# Altium project PCI_board_universal.PrjPCB (part 1 of 2)
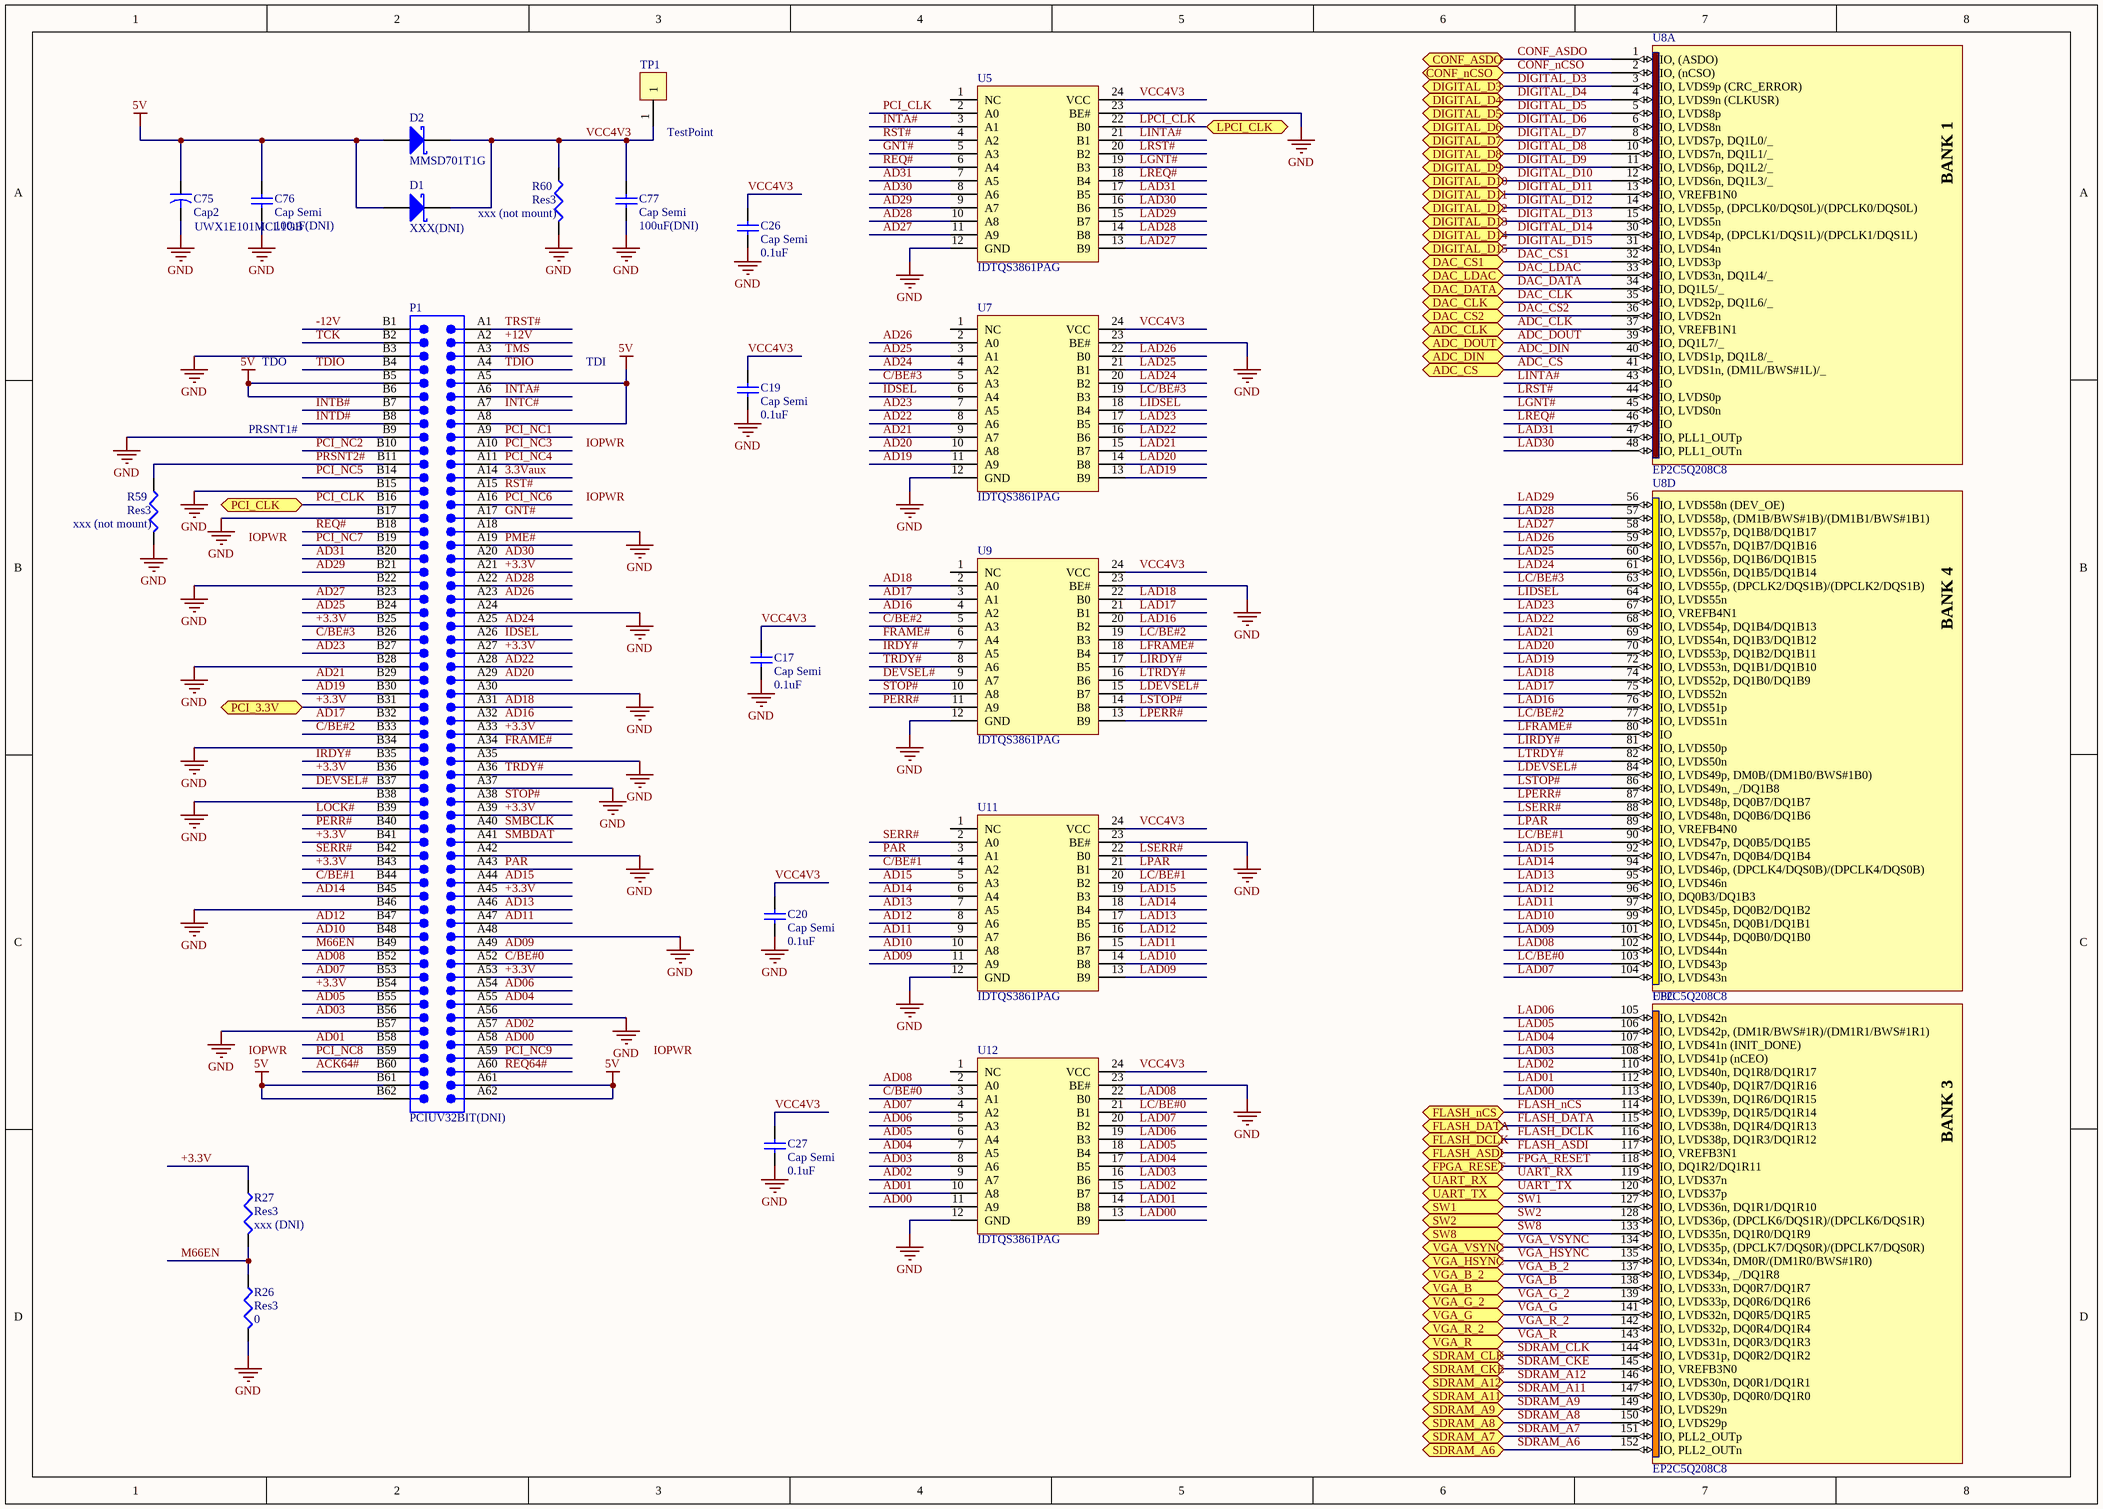
[diagram p0: PCI short card universal - 32 BIT.schdoc]
7 sheets, 200 parts. Net scope: flat (ports and power ports of the same name join across sheets).
Board file: PCI short card universal - 32 BIT.PCBDOC
Sheets:
  PCI short card universal - 32 BIT.schdoc
  PCI short card universal - 32 BIT-2.schdoc
  PCI short card universal - 32 BIT-3.schdoc
  PCI short card universal - 32 BIT-4.schdoc
  PCI short card universal - 32 BIT-5.schdoc
  PCI short card universal - 32 BIT-6.schdoc
  PCI short card universal - 32 BIT-7.schdoc

## Sheet PCI short card universal - 32 BIT.schdoc: PCI short card universal - 32 BIT
size A3; Organization: Organization; Address1: Address1; Address2: Address2; Address3: Address3; Address4: Address4; DocumentNumber: 1; Revision: 0; SheetNumber: 2; SheetTotal: 2; PageSetup: Record=PageOptions|CenterHorizontal=True|CenterVertical=True|PrintScale=0.70|XCorrection=1.00|YCorrection=1.00|PrintKind=1|BorderSize=5000000|LeftOffset=0|BottomOffset=0|Orientation=2|PaperLength=1000|PaperWidth=1000|Scale=100|PaperSource=15|PrintQuality=600|MediaType=1|DitherType=10|PaperKind=Letter|PrintScaleMode=1

### Parts
C17  Cap Semi  value 0.1uF  [RESC1608N]
C19  Cap Semi  value 0.1uF  [RESC1608N]
C20  Cap Semi  value 0.1uF  [RESC1608N]
C26  Cap Semi  value 0.1uF  [RESC1608N]
C27  Cap Semi  value 0.1uF  [RESC1608N]
C75  Cap2  value UWX1E101MCL1GB  [ECEL_D8]
C76  Cap Semi  value 100uF(DNI)  [CD3225-1210]
C77  Cap Semi  value 100uF(DNI)  [CD3225-1210]
D1  XXX(DNI)  [LED3.2X1.6X1.1]
D2  MMSD701T1G  [SOD-123]
P1  PCIUV32BIT(DNI)  [PCIUV32BIT]
R26  Res3  value 0  [RESC1608N]
R27  Res3  value xxx (DNI)  [RESC1608N]
R59  Res3  value xxx (not mount)  [RESC1608N]
R60  Res3  value xxx (not mount)  [RESC1608N]
TP1  TestPoint  [HDR1X1]
U5  IDTQS3861PAG  [TSSOP24(QS3681)]
U7  IDTQS3861PAG  [TSSOP24(QS3681)]
U8  EP2C5Q208C8  [PQFP208_N]  (parts A,C,D of 9)
U9  IDTQS3861PAG  [TSSOP24(QS3681)]
U11  IDTQS3861PAG  [TSSOP24(QS3681)]
U12  IDTQS3861PAG  [TSSOP24(QS3681)]

### Ports
ADC_CLK, ADC_CS, ADC_DIN, ADC_DOUT, CONF_ASDO, CONF_nCSO, DAC_CLK, DAC_CS1, DAC_CS2, DAC_DATA, DAC_LDAC, DIGITAL_D3, DIGITAL_D4, DIGITAL_D5, DIGITAL_D6, DIGITAL_D7, DIGITAL_D8, DIGITAL_D9, DIGITAL_D10, DIGITAL_D11, DIGITAL_D12, DIGITAL_D13, DIGITAL_D14, DIGITAL_D15, FLASH_ASDI, FLASH_DATA, FLASH_DCLK, FLASH_nCS, FPGA_RESET, LPCI_CLK, PCI_3.3V, PCI_CLK, SDRAM_A6, SDRAM_A7, SDRAM_A8, SDRAM_A9, SDRAM_A11, SDRAM_A12, SDRAM_CKE, SDRAM_CLK, SW1, SW2, SW8, UART_RX, UART_TX, VGA_B, VGA_B_2, VGA_G, VGA_G_2, VGA_HSYNC, VGA_R, VGA_R_2, VGA_VSYNC

### Nets
5V: C75.1 C76.2 D1.1(A) D2.1(A) P1.A5 P1.A8 P1.A61 P1.A62 P1.B5 P1.B6 P1.B61 P1.B62
GND: C17.1 C19.1 C20.1 C26.1 C27.1 C75.2 C76.1 C77.1 P1.A18 P1.A24 P1.A30 P1.A35 P1.A37 P1.A42 P1.A48 P1.A56 P1.B3 P1.B9 P1.B15 P1.B17 P1.B22 P1.B28 P1.B34 P1.B38 P1.B46 P1.B57 R26.2 R59.2 R60.2 U5.12(GND) U5.23(BE#) U7.12(GND) U7.23(BE#) U9.12(GND) U9.23(BE#) U11.12(GND) U11.23(BE#) U12.12(GND) U12.23(BE#)
3.3Vaux: P1.A14
+3.3V: P1.A21 P1.A27 P1.A33 P1.A39 P1.A45 P1.A53 P1.B25 P1.B31 P1.B36 P1.B41 P1.B43 P1.B54 R27.1 ; port PCI_3.3V
+12V: P1.A2
-12V: P1.B1
ACK64#: P1.B60
AD00: P1.A58 U12.11(A9)
AD01: P1.B58 U12.10(A8)
AD02: P1.A57 U12.9(A7)
AD03: P1.B56 U12.8(A6)
AD04: P1.A55 U12.7(A5)
AD05: P1.B55 U12.6(A4)
AD06: P1.A54 U12.5(A3)
AD07: P1.B53 U12.4(A2)
AD08: P1.B52 U12.2(A0)
AD09: P1.A49 U11.11(A9)
AD10: P1.B48 U11.10(A8)
AD11: P1.A47 U11.9(A7)
AD12: P1.B47 U11.8(A6)
AD13: P1.A46 U11.7(A5)
AD14: P1.B45 U11.6(A4)
AD15: P1.A44 U11.5(A3)
AD16: P1.A32 U9.4(A2)
AD17: P1.B32 U9.3(A1)
AD18: P1.A31 U9.2(A0)
AD19: P1.B30 U7.11(A9)
AD20: P1.A29 U7.10(A8)
AD21: P1.B29 U7.9(A7)
AD22: P1.A28 U7.8(A6)
AD23: P1.B27 U7.7(A5)
AD24: P1.A25 U7.4(A2)
AD25: P1.B24 U7.3(A1)
AD26: P1.A23 U7.2(A0)
AD27: P1.B23 U5.11(A9)
AD28: P1.A22 U5.10(A8)
AD29: P1.B21 U5.9(A7)
AD30: P1.A20 U5.8(A6)
AD31: P1.B20 U5.7(A5)
ADC_CLK: U8.37(IO,_VREFB1N1) ; port ADC_CLK
ADC_CS: U8.41(IO,_LVDS1n,_(DM1L/BWS#1L)/_) ; port ADC_CS
ADC_DIN: U8.40(IO,_LVDS1p,_DQ1L8/_) ; port ADC_DIN
ADC_DOUT: U8.39(IO,_DQ1L7/_) ; port ADC_DOUT
C/BE#0: P1.A52 U12.3(A1)
C/BE#1: P1.B44 U11.4(A2)
C/BE#2: P1.B33 U9.5(A3)
C/BE#3: P1.B26 U7.5(A3)
CONF_ASDO: U8.1(IO,_(ASDO)) ; port CONF_ASDO
CONF_nCSO: U8.2(IO,_(nCSO)) ; port CONF_nCSO
DAC_CLK: U8.35(IO,_LVDS2p,_DQ1L6/_) ; port DAC_CLK
DAC_CS1: U8.32(IO,_LVDS3p) ; port DAC_CS1
DAC_CS2: U8.36(IO,_LVDS2n) ; port DAC_CS2
DAC_DATA: U8.34(IO,_DQ1L5/_) ; port DAC_DATA
DAC_LDAC: U8.33(IO,_LVDS3n,_DQ1L4/_) ; port DAC_LDAC
DEVSEL#: P1.B37 U9.9(A7)
DIGITAL_D3: U8.3(IO,_LVDS9p_(CRC_ERROR)) ; port DIGITAL_D3
DIGITAL_D4: U8.4(IO,_LVDS9n_(CLKUSR)) ; port DIGITAL_D4
DIGITAL_D5: U8.5(IO,_LVDS8p) ; port DIGITAL_D5
DIGITAL_D6: U8.6(IO,_LVDS8n) ; port DIGITAL_D6
DIGITAL_D7: U8.8(IO,_LVDS7p,_DQ1L0/_) ; port DIGITAL_D7
DIGITAL_D8: U8.10(IO,_LVDS7n,_DQ1L1/_) ; port DIGITAL_D8
DIGITAL_D9: U8.11(IO,_LVDS6p,_DQ1L2/_) ; port DIGITAL_D9
DIGITAL_D10: U8.12(IO,_LVDS6n,_DQ1L3/_) ; port DIGITAL_D10
DIGITAL_D11: U8.13(IO,_VREFB1N0) ; port DIGITAL_D11
DIGITAL_D12: U8.14(IO,_LVDS5p,_(DPCLK0/DQS0L)/(DPCLK0/DQS0L)) ; port DIGITAL_D12
DIGITAL_D13: U8.15(IO,_LVDS5n) ; port DIGITAL_D13
DIGITAL_D14: U8.30(IO,_LVDS4p,_(DPCLK1/DQS1L)/(DPCLK1/DQS1L)) ; port DIGITAL_D14
DIGITAL_D15: U8.31(IO,_LVDS4n) ; port DIGITAL_D15
FLASH_ASDI: U8.117(IO,_VREFB3N1) ; port FLASH_ASDI
FLASH_DATA: U8.115(IO,_LVDS38n,_DQ1R4/DQ1R13) ; port FLASH_DATA
FLASH_DCLK: U8.116(IO,_LVDS38p,_DQ1R3/DQ1R12) ; port FLASH_DCLK
FLASH_nCS: U8.114(IO,_LVDS39p,_DQ1R5/DQ1R14) ; port FLASH_nCS
FPGA_RESET: U8.118(IO,_DQ1R2/DQ1R11) ; port FPGA_RESET
FRAME#: P1.A34 U9.6(A4)
GNT#: P1.A17 U5.5(A3)
IDSEL: P1.A26 U7.6(A4)
INTA#: P1.A6 U5.3(A1)
INTB#: P1.B7
INTC#: P1.A7
INTD#: P1.B8
IRDY#: P1.B35 U9.7(A5)
LAD00: U8.113(IO,_LVDS39n,_DQ1R6/DQ1R15) U12.13(B9)
LAD01: U8.112(IO,_LVDS40p,_DQ1R7/DQ1R16) U12.14(B8)
LAD02: U8.110(IO,_LVDS40n,_DQ1R8/DQ1R17) U12.15(B7)
LAD03: U8.108(IO,_LVDS41p_(nCEO)) U12.16(B6)
LAD04: U8.107(IO,_LVDS41n_(INIT_DONE)) U12.17(B5)
LAD05: U8.106(IO,_LVDS42p,_(DM1R/BWS#1R)/(DM1R1/BWS#1R1)) U12.18(B4)
LAD06: U8.105(IO,_LVDS42n) U12.19(B3)
LAD07: U8.104(IO,_LVDS43n) U12.20(B2)
LAD08: U8.102(IO,_LVDS44n) U12.22(B0)
LAD09: U8.101(IO,_LVDS44p,_DQ0B0/DQ1B0) U11.13(B9)
LAD10: U8.99(IO,_LVDS45n,_DQ0B1/DQ1B1) U11.14(B8)
LAD11: U8.97(IO,_LVDS45p,_DQ0B2/DQ1B2) U11.15(B7)
LAD12: U8.96(IO,_DQ0B3/DQ1B3) U11.16(B6)
LAD13: U8.95(IO,_LVDS46n) U11.17(B5)
LAD14: U8.94(IO,_LVDS46p,_(DPCLK4/DQS0B)/(DPCLK4/DQS0B)) U11.18(B4)
LAD15: U8.92(IO,_LVDS47n,_DQ0B4/DQ1B4) U11.19(B3)
LAD16: U8.76(IO,_LVDS51p) U9.20(B2)
LAD17: U8.75(IO,_LVDS52n) U9.21(B1)
LAD18: U8.74(IO,_LVDS52p,_DQ1B0/DQ1B9) U9.22(B0)
LAD19: U7.13(B9) U8.72(IO,_LVDS53n,_DQ1B1/DQ1B10)
LAD20: U7.14(B8) U8.70(IO,_LVDS53p,_DQ1B2/DQ1B11)
LAD21: U7.15(B7) U8.69(IO,_LVDS54n,_DQ1B3/DQ1B12)
LAD22: U7.16(B6) U8.68(IO,_LVDS54p,_DQ1B4/DQ1B13)
LAD23: U7.17(B5) U8.67(IO,_VREFB4N1)
LAD24: U7.20(B2) U8.61(IO,_LVDS56n,_DQ1B5/DQ1B14)
LAD25: U7.21(B1) U8.60(IO,_LVDS56p,_DQ1B6/DQ1B15)
LAD26: U7.22(B0) U8.59(IO,_LVDS57n,_DQ1B7/DQ1B16)
LAD27: U5.13(B9) U8.58(IO,_LVDS57p,_DQ1B8/DQ1B17)
LAD28: U5.14(B8) U8.57(IO,_LVDS58p,_(DM1B/BWS#1B)/(DM1B1/BWS#1B1))
LAD29: U5.15(B7) U8.56(IO,_LVDS58n_(DEV_OE))
LAD30: U5.16(B6) U8.48(IO,_PLL1_OUTn)
LAD31: U5.17(B5) U8.47(IO,_PLL1_OUTp)
LC/BE#0: U8.103(IO,_LVDS43p) U12.21(B1)
LC/BE#1: U8.90(IO,_LVDS47p,_DQ0B5/DQ1B5) U11.20(B2)
LC/BE#2: U8.77(IO,_LVDS51n) U9.19(B3)
LC/BE#3: U7.19(B3) U8.63(IO,_LVDS55p,_(DPCLK2/DQS1B)/(DPCLK2/DQS1B))
LDEVSEL#: U8.84(IO,_LVDS49p,_DM0B/(DM1B0/BWS#1B0)) U9.15(B7)
LFRAME#: U8.80(IO) U9.18(B4)
LGNT#: U5.19(B3) U8.45(IO,_LVDS0n)
LIDSEL: U7.18(B4) U8.64(IO,_LVDS55n)
LINTA#: U5.21(B1) U8.43(IO)
LIRDY#: U8.81(IO,_LVDS50p) U9.17(B5)
LOCK#: P1.B39
LPAR: U8.89(IO,_VREFB4N0) U11.21(B1)
LPCI_CLK: U5.22(B0) ; port LPCI_CLK
LPERR#: U8.87(IO,_LVDS48p,_DQ0B7/DQ1B7) U9.13(B9)
LREQ#: U5.18(B4) U8.46(IO)
LRST#: U5.20(B2) U8.44(IO,_LVDS0p)
LSERR#: U8.88(IO,_LVDS48n,_DQ0B6/DQ1B6) U11.22(B0)
LSTOP#: U8.86(IO,_LVDS49n,__/DQ1B8) U9.14(B8)
LTRDY#: U8.82(IO,_LVDS50n) U9.16(B6)
M66EN: P1.B49 R26.1 R27.2
PAR: P1.A43 U11.3(A1)
PCI_CLK: P1.B16 U5.2(A0) ; port PCI_CLK
PCI_NC1: P1.A9
PCI_NC2: P1.B10
PCI_NC3: P1.A10
PCI_NC4: P1.A11
PCI_NC5: P1.B14
PCI_NC6: P1.A16
PCI_NC7: P1.B19
PCI_NC8: P1.B59
PCI_NC9: P1.A59
PERR#: P1.B40 U9.11(A9)
PME#: P1.A19
PRSNT2#: P1.B11 R59.1
REQ64#: P1.A60
REQ#: P1.B18 U5.6(A4)
RST#: P1.A15 U5.4(A2)
SDRAM_A6: U8.152(IO,_PLL2_OUTn) ; port SDRAM_A6
SDRAM_A7: U8.151(IO,_PLL2_OUTp) ; port SDRAM_A7
SDRAM_A8: U8.150(IO,_LVDS29p) ; port SDRAM_A8
SDRAM_A9: U8.149(IO,_LVDS29n) ; port SDRAM_A9
SDRAM_A11: U8.147(IO,_LVDS30p,_DQ0R0/DQ1R0) ; port SDRAM_A11
SDRAM_A12: U8.146(IO,_LVDS30n,_DQ0R1/DQ1R1) ; port SDRAM_A12
SDRAM_CKE: U8.145(IO,_VREFB3N0) ; port SDRAM_CKE
SDRAM_CLK: U8.144(IO,_LVDS31p,_DQ0R2/DQ1R2) ; port SDRAM_CLK
SERR#: P1.B42 U11.2(A0)
SMBCLK: P1.A40
SMBDAT: P1.A41
STOP#: P1.A38 U9.10(A8)
SW1: U8.127(IO,_LVDS36n,_DQ1R1/DQ1R10) ; port SW1
SW2: U8.128(IO,_LVDS36p,_(DPCLK6/DQS1R)/(DPCLK6/DQS1R)) ; port SW2
SW8: U8.133(IO,_LVDS35n,_DQ1R0/DQ1R9) ; port SW8
TCK: P1.B2
TDIO: P1.A4 P1.B4
TMS: P1.A3
TRDY#: P1.A36 U9.8(A6)
TRST#: P1.A1
UART_RX: U8.119(IO,_LVDS37n) ; port UART_RX
UART_TX: U8.120(IO,_LVDS37p) ; port UART_TX
VCC4V3: C17.2 C19.2 C20.2 C26.2 C27.2 C77.2 D1.2(K) D2.2(K) R60.1 TP1.1 U5.24(VCC) U7.24(VCC) U9.24(VCC) U11.24(VCC) U12.24(VCC)
VGA_B: U8.138(IO,_LVDS33n,_DQ0R7/DQ1R7) ; port VGA_B
VGA_B_2: U8.137(IO,_LVDS34p,__/DQ1R8) ; port VGA_B_2
VGA_G: U8.141(IO,_LVDS32n,_DQ0R5/DQ1R5) ; port VGA_G
VGA_G_2: U8.139(IO,_LVDS33p,_DQ0R6/DQ1R6) ; port VGA_G_2
VGA_HSYNC: U8.135(IO,_LVDS34n,_DM0R/(DM1R0/BWS#1R0)) ; port VGA_HSYNC
VGA_R: U8.143(IO,_LVDS31n,_DQ0R3/DQ1R3) ; port VGA_R
VGA_R_2: U8.142(IO,_LVDS32p,_DQ0R4/DQ1R4) ; port VGA_R_2
VGA_VSYNC: U8.134(IO,_LVDS35p,_(DPCLK7/DQS0R)/(DPCLK7/DQS0R)) ; port VGA_VSYNC

Not connected (* = marked no-connect by the designer): U5 1(NC); U7 1(NC); U9 1(NC); U11 1(NC); U12 1(NC)

### Notes on the sheet
- TDO
- TDI
- PRSNT1#
- Labels drawn without touching a wire or pin: IOPWR
- (in symbol EP2C5Q208C8, part A) BANK 1
- (in symbol EP2C5Q208C8, part C) BANK 3
- (in symbol EP2C5Q208C8, part D) BANK 4

### Library data of the parts
C17 C19 C20 C26 C27 = Cap Semi: Capacitor (Semiconductor SIM Model); Published: 8-Jun-2000; LatestRevisionDate: 17-Jul-2002; LatestRevisionNote: Re-released for DXP Platform.; PackageReference: C1206; Publisher: Altium Limited
C75 = Cap2: NICHICON; Published: 23-Sep-2002; PackageReference: CAPR5-4X5; Publisher: Altium Limited
D1 = D Schottky: Schottky Diode; Published: 8-Jun-2000; LatestRevisionDate: 17-Jul-2002; LatestRevisionNote: Re-released for DXP Platform.; PackageReference: SMB; Publisher: Altium Limited; Code_JEDEC: DO-214-AA
D2 = D Schottky: ON SEMI; Published: 8-Jun-2000; LatestRevisionDate: 17-Jul-2002; LatestRevisionNote: Re-released for DXP Platform.; PackageReference: SMB; Publisher: Altium Limited; Code_JEDEC: DO-214-AA
P1 = PCIUV32BIT: Card, 116-Position; Text Field6: Pins A12, A13, B12, B13, A50, A51, B50 & B51 are not present.  Alternate Layout Available; Text Field7: Published 14-Feb-2002
R26 R27 R59 R60 = Res3: Resistor; Published: 8-Jun-2000; LatestRevisionDate: 04-Mar-2005; LatestRevisionNote: PCB Footprint replaced.; PackageReference: J1-0603; Publisher: Altium Limited
U5 U7 U9 U11 U12 = QS3861: IDT
U8 = EP2C5Q208C8: ALTERA Cyclone II Family, 1.2V FPGA, 142 I/O Pins, 2 PLLs, 208-Pin PQFP, Speed Grade 8, Commercial Grade; Note: DQS signal pins named according to DQ bus modes.  "/" separates each mode. ie. Modes x8/x9 / Modes x16/x18.; Published: 4-Mar-2005; LatestRevisionDate: 13-Apr-2006; LatestRevisionNote: IPC-7351 Footprint Added.; DatasheetVersion: ver2.3, Mar-2006; PackageVersion: ver14.2, Oct-2005; PackageReference: PQFP208; Publisher: Altium Limited; PackageDescription: 208-Pin Plastic Quad Flat Pack (PQFP208); Code_JEDEC: MS-029-FA-1; ComponentLink1Description: Manufacturer Link; ComponentLink1URL: http://www.altera.com/products/devices/cyclone2/cy2-index.jsp; ComponentLink2Description: Handbook; ComponentLink2URL: http://www.altera.com/literature/hb/cyc2/cyc2_cii5v1.pdf; ComponentLink3Description: Packaging Specification; ComponentLink3URL: http://www.altera.com/literature/ds/dspkg.pdf
C76 C77 = Cap Semi: Published: 8-Jun-2000; LatestRevisionDate: 17-Jul-2002; LatestRevisionNote: Re-released for DXP Platform.; PackageReference: C1206; Publisher: Altium Limited

## Sheet PCI short card universal - 32 BIT-2.schdoc
size A3
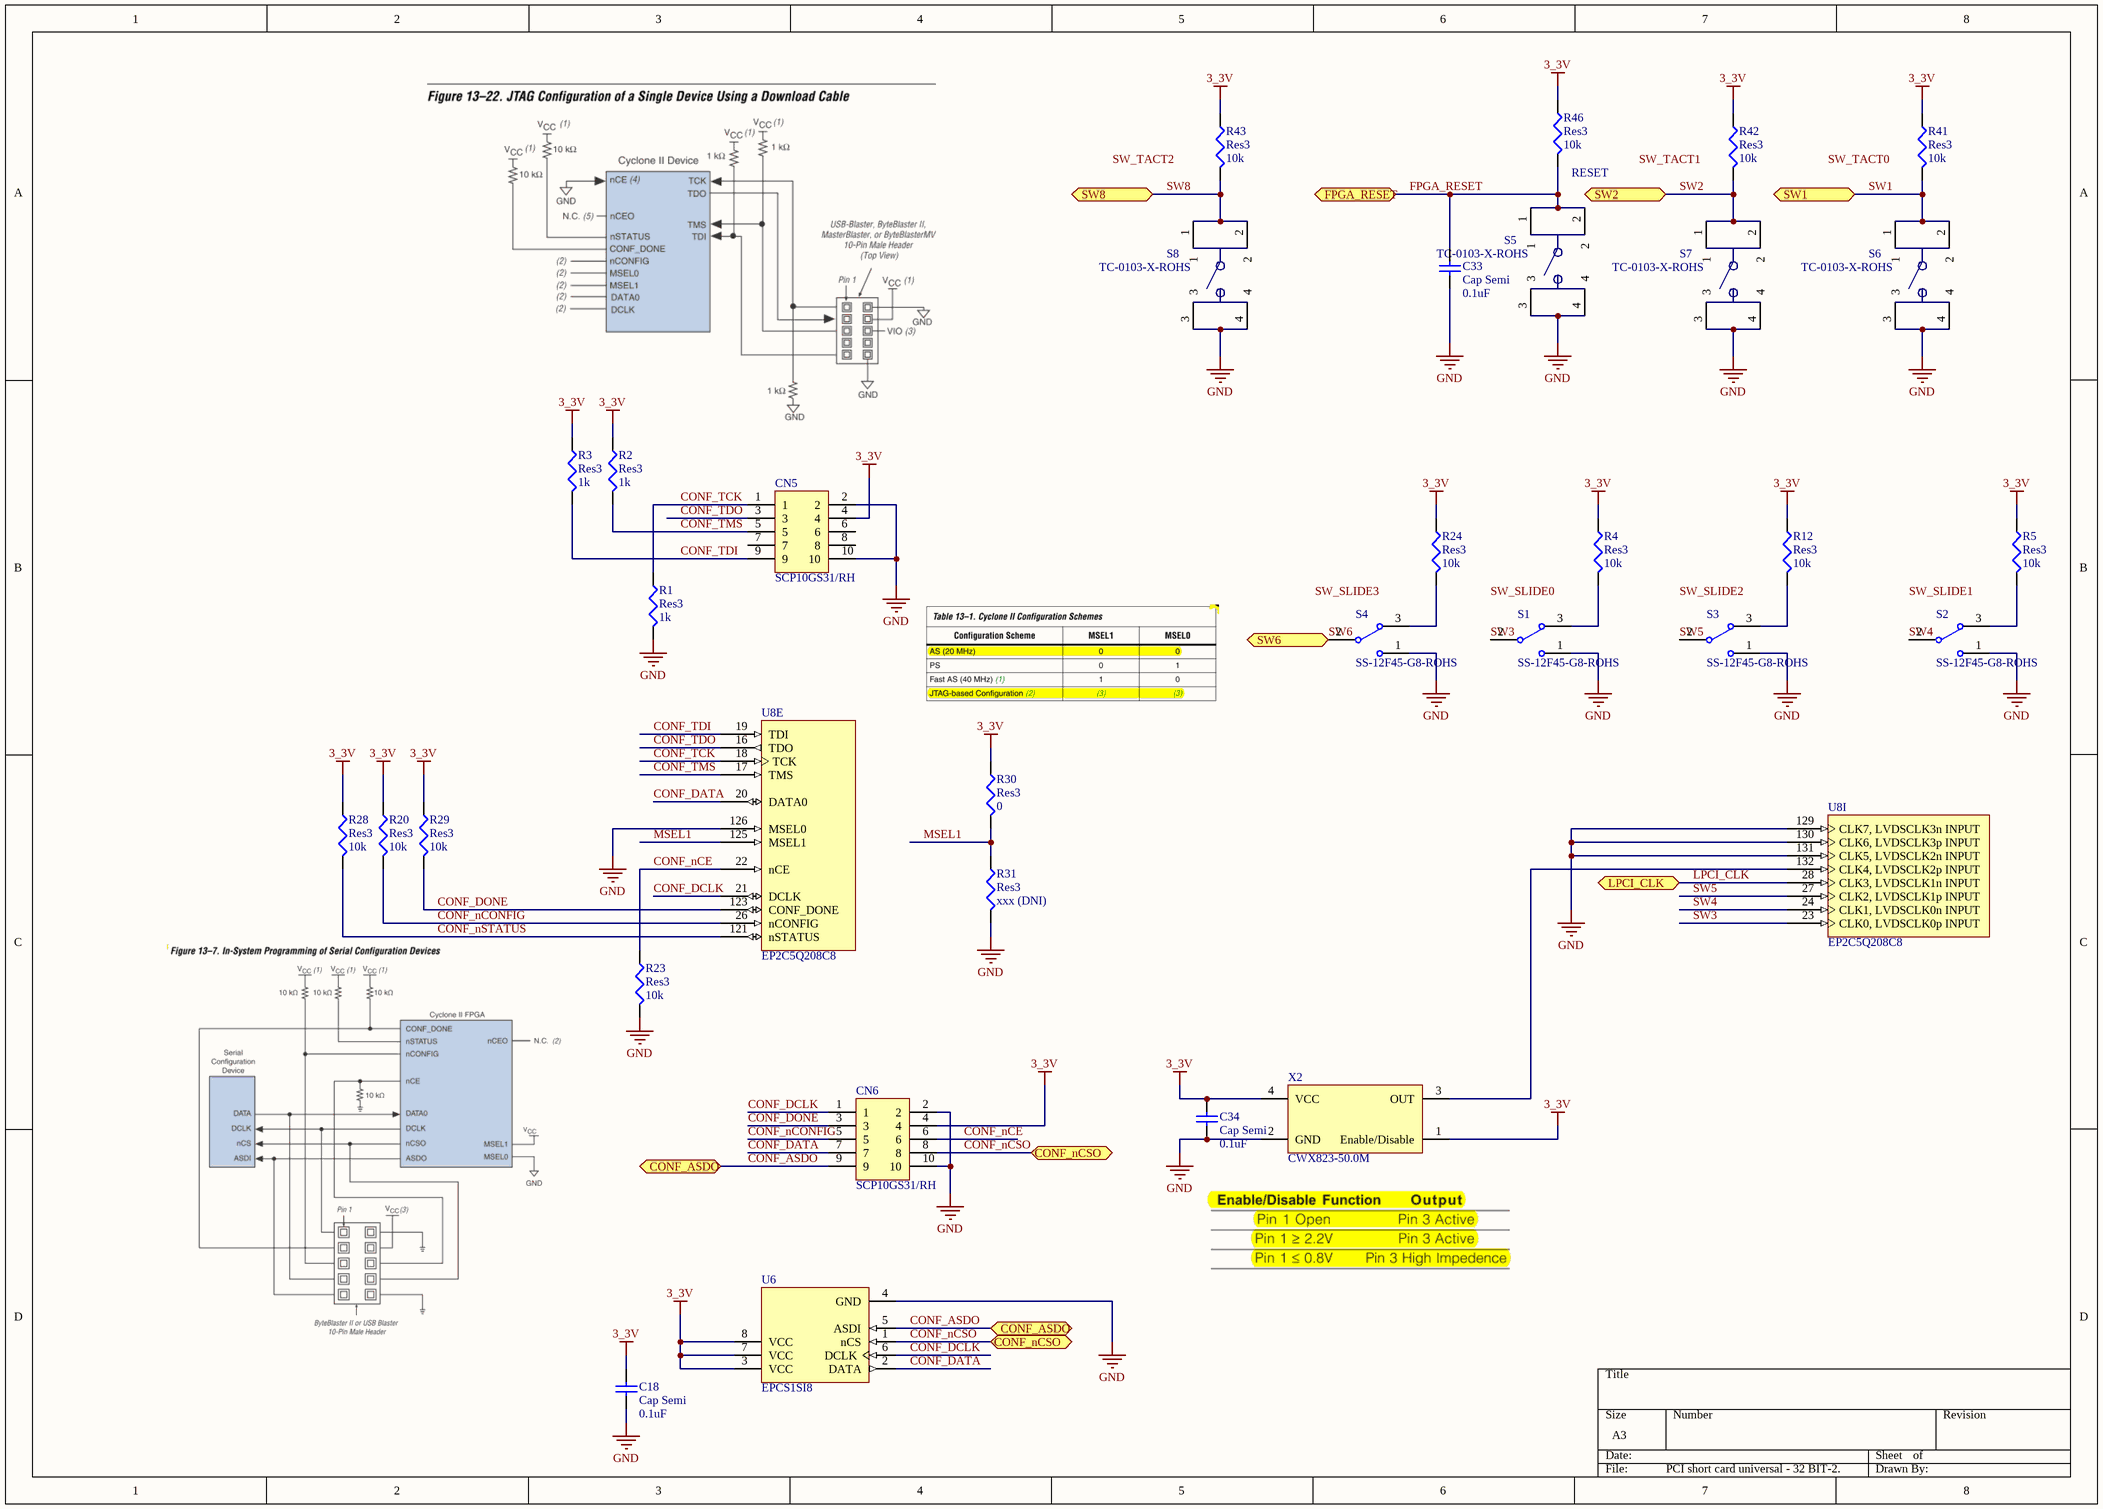
[diagram p1: PCI short card universal - 32 BIT-2.schdoc]

### Parts
C18  Cap Semi  value 0.1uF  [RESC1608N]
C33  Cap Semi  value 0.1uF  [RESC1608N]
C34  Cap Semi  value 0.1uF  [RESC1608N]
CN5  SCP10GS31/RH  [SCP10GS31/RH]
CN6  SCP10GS31/RH  [SCP10GS31/RH]
R1  Res3  value 1k  [RESC1608N]
R2  Res3  value 1k  [RESC1608N]
R3  Res3  value 1k  [RESC1608N]
R4  Res3  value 10k  [RESC1608N]
R5  Res3  value 10k  [RESC1608N]
R12  Res3  value 10k  [RESC1608N]
R20  Res3  value 10k  [RESC1608N]
R23  Res3  value 10k  [RESC1608N]
R24  Res3  value 10k  [RESC1608N]
R28  Res3  value 10k  [RESC1608N]
R29  Res3  value 10k  [RESC1608N]
R30  Res3  value 0  [RESC1608N]
R31  Res3  value xxx (DNI)  [RESC1608N]
R41  Res3  value 10k  [RESC1608N]
R42  Res3  value 10k  [RESC1608N]
R43  Res3  value 10k  [RESC1608N]
R46  Res3  value 10k  [RESC1608N]
S1  SS-12F45-G8-ROHS  [SLIDE_SW_2TYPE]
S2  SS-12F45-G8-ROHS  [SLIDE_SW_2TYPE]
S3  SS-12F45-G8-ROHS  [SLIDE_SW_2TYPE]
S4  SS-12F45-G8-ROHS  [SLIDE_SW_2TYPE]
S5  TC-0103-X-ROHS  [TACK_SW 6x6mm]
S6  TC-0103-X-ROHS  [TACK_SW 6x6mm]
S7  TC-0103-X-ROHS  [TACK_SW 6x6mm]
S8  TC-0103-X-ROHS  [TACK_SW 6x6mm]
U6  EPCS1SI8  [SOIC8_L]
U8  EP2C5Q208C8  [PQFP208_N]  (parts E,I of 9)
X2  CWX823-50.0M  [CWX823-50.0M]

### Ports
CONF_ASDO, CONF_nCSO, FPGA_RESET, LPCI_CLK, SW1, SW2, SW6, SW8

### Nets
3_3V: C18.2 C34.2 CN5.4 CN6.4 R2.1 R3.1 R4.1 R5.1 R12.1 R20.1 R24.1 R28.1 R29.1 R30.1 R41.1 R42.1 R43.1 R46.1 U6.3(VCC) U6.7(VCC) U6.8(VCC) X2.1(Enable/Disable) X2.4(VCC)
GND: C18.1 C33.1 C34.1 CN5.2 CN5.10 CN6.2 CN6.10 R1.2 R23.2 R31.2 S1.1 S2.1 S3.1 S4.1 S5.3 S5.4 S6.3 S6.4 S7.3 S7.4 S8.3 S8.4 U6.4(GND) U8.126(MSEL0) U8.129(CLK7,_LVDSCLK3n_INPUT) U8.130(CLK6,_LVDSCLK3p_INPUT) U8.131(CLK5,_LVDSCLK2n_INPUT) X2.2(GND)
CONF_ASDO: CN6.9 U6.5(ASDI) ; port CONF_ASDO
CONF_DATA: CN6.7 U6.2(DATA) U8.20(DATA0)
CONF_DCLK: CN6.1 U6.6(DCLK) U8.21(DCLK)
CONF_DONE: CN6.3 R29.2 U8.123(CONF_DONE)
CONF_nCE: CN6.6 R23.1 U8.22(nCE)
CONF_nCONFIG: CN6.5 R20.2 U8.26(nCONFIG)
CONF_nCSO: CN6.8 U6.1(nCS) ; port CONF_nCSO
CONF_nSTATUS: R28.2 U8.121(nSTATUS)
CONF_TCK: CN5.1 R1.1 U8.18(TCK)
CONF_TDI: CN5.9 R3.2 U8.19(TDI)
CONF_TDO: CN5.3 U8.16(TDO)
CONF_TMS: CN5.5 R2.2 U8.17(TMS)
FPGA_RESET: C33.2 R46.2 S5.1 S5.2 ; port FPGA_RESET
LPCI_CLK: U8.28(CLK3,_LVDSCLK1n_INPUT) ; port LPCI_CLK
MSEL1: R30.2 R31.1 U8.125(MSEL1)
SW1: R41.2 S6.1 S6.2 ; port SW1
SW2: R42.2 S7.1 S7.2 ; port SW2
SW3: S1.2 U8.23(CLK0,_LVDSCLK0p_INPUT)
SW4: S2.2 U8.24(CLK1,_LVDSCLK0n_INPUT)
SW5: S3.2 U8.27(CLK2,_LVDSCLK1p_INPUT)
SW6: S4.2 ; port SW6
SW8: R43.2 S8.1 S8.2 ; port SW8
NetR4_2: R4.2 S1.3
NetR5_2: R5.2 S2.3
NetR12_2: R12.2 S3.3
NetR24_2: R24.2 S4.3
NetU8_132: U8.132(CLK4,_LVDSCLK2p_INPUT) X2.3(OUT)

Not connected (* = marked no-connect by the designer): CN5 6 7 8

### Notes on the sheet
- (near R46) RESET
- Labels drawn without touching a wire or pin: SW_SLIDE0, SW_SLIDE1, SW_SLIDE2, SW_SLIDE3, SW_TACT0, SW_TACT1, SW_TACT2

### Library data of the parts
C18 C33 C34 = Cap Semi: Capacitor (Semiconductor SIM Model); Published: 8-Jun-2000; LatestRevisionDate: 17-Jul-2002; LatestRevisionNote: Re-released for DXP Platform.; PackageReference: C1206; Publisher: Altium Limited
CN5 = SCP10GS31/RH: GTK
R1-R5 R12 R20 R23 R24 R28-R31 R41-R43 R46 = Res3: Resistor; Published: 8-Jun-2000; LatestRevisionDate: 04-Mar-2005; LatestRevisionNote: PCB Footprint replaced.; PackageReference: J1-0603; Publisher: Altium Limited
S1-S4 = SW-SPDT: WEALTH METAL; Published: 24-Mar-1999; LatestRevisionDate: 17-Dec-2003; LatestRevisionNote: Schematic revised, PCB Footprint replaced.; DatasheetDocument: 05-Dec-2000; PackageReference: TL36WW15050; Publisher: Altium Limited; ComponentLink1Description: Manufacturer Link; ComponentLink1URL: http://www.apem.com
S5-S8 = TC-0103-X-ROHS: WEALTH METAL
U6 = EPCS1SI8: ALTERA EPCS1 Series, In-system programmable 3.3V serial configuration device, 8-Pin SOIC, 1-Megabit, Industrial Grade; Configures: Cyclone II, Stratix II, & Cyclone Devices; Published: 17-Sep-2003; LatestRevisionDate: 13-Apr-2006; LatestRevisionNote: IPC-7351 Footprint Added.; DatasheetVersion: ver2.0, Oct-2003; PackageVersion: ver13.0, May-2005; PackageReference: SOIC8; Publisher: Altium Limited; PackageDescription: 8-Pin Small Outline Integrated Circuit Package (SOIC8); Code_JEDEC: MS-012-AA; Code_IPC: SOIC127P600-8; ComponentLink1Description: Manufacturer Link; ComponentLink1URL: http://www.altera.com/products/devices/config/cfg-index.html; ComponentLink2Description: Configuration Handbook; ComponentLink2URL: http://www.altera.com/literature/hb/cfg/config_handbook.pdf; ComponentLink3Description: Pinout Specification; ComponentLink3URL: http://www.altera.com/literature/hb/cfg/cyc_c51014.pdf; ComponentLink4Description: Packaging Specification; ComponentLink4URL: http://www.altera.com/literature/ds/dspkg.pdf
U8 = EP2C5Q208C8: as U8 on sheet PCI short card universal - 32 BIT; Published: 4-Mar-2005; LatestRevisionDate: 13-Apr-2006; LatestRevisionNote: IPC-7351 Footprint Added.; DatasheetVersion: ver2.3, Mar-2006; PackageVersion: ver14.2, Oct-2005; PackageReference: PQFP208; Publisher: Altium Limited; PackageDescription: 208-Pin Plastic Quad Flat Pack (PQFP208); Code_JEDEC: MS-029-FA-1; ComponentLink1Description: Manufacturer Link; ComponentLink1URL: http://www.altera.com/products/devices/cyclone2/cy2-index.jsp; ComponentLink2Description: Handbook; ComponentLink2URL: http://www.altera.com/literature/hb/cyc2/cyc2_cii5v1.pdf; ComponentLink3Description: Packaging Specification; ComponentLink3URL: http://www.altera.com/literature/ds/dspkg.pdf
X2 = CWX823-50.0M: CONNOR-WINFIELD

## Sheet PCI short card universal - 32 BIT-3.schdoc
size A3
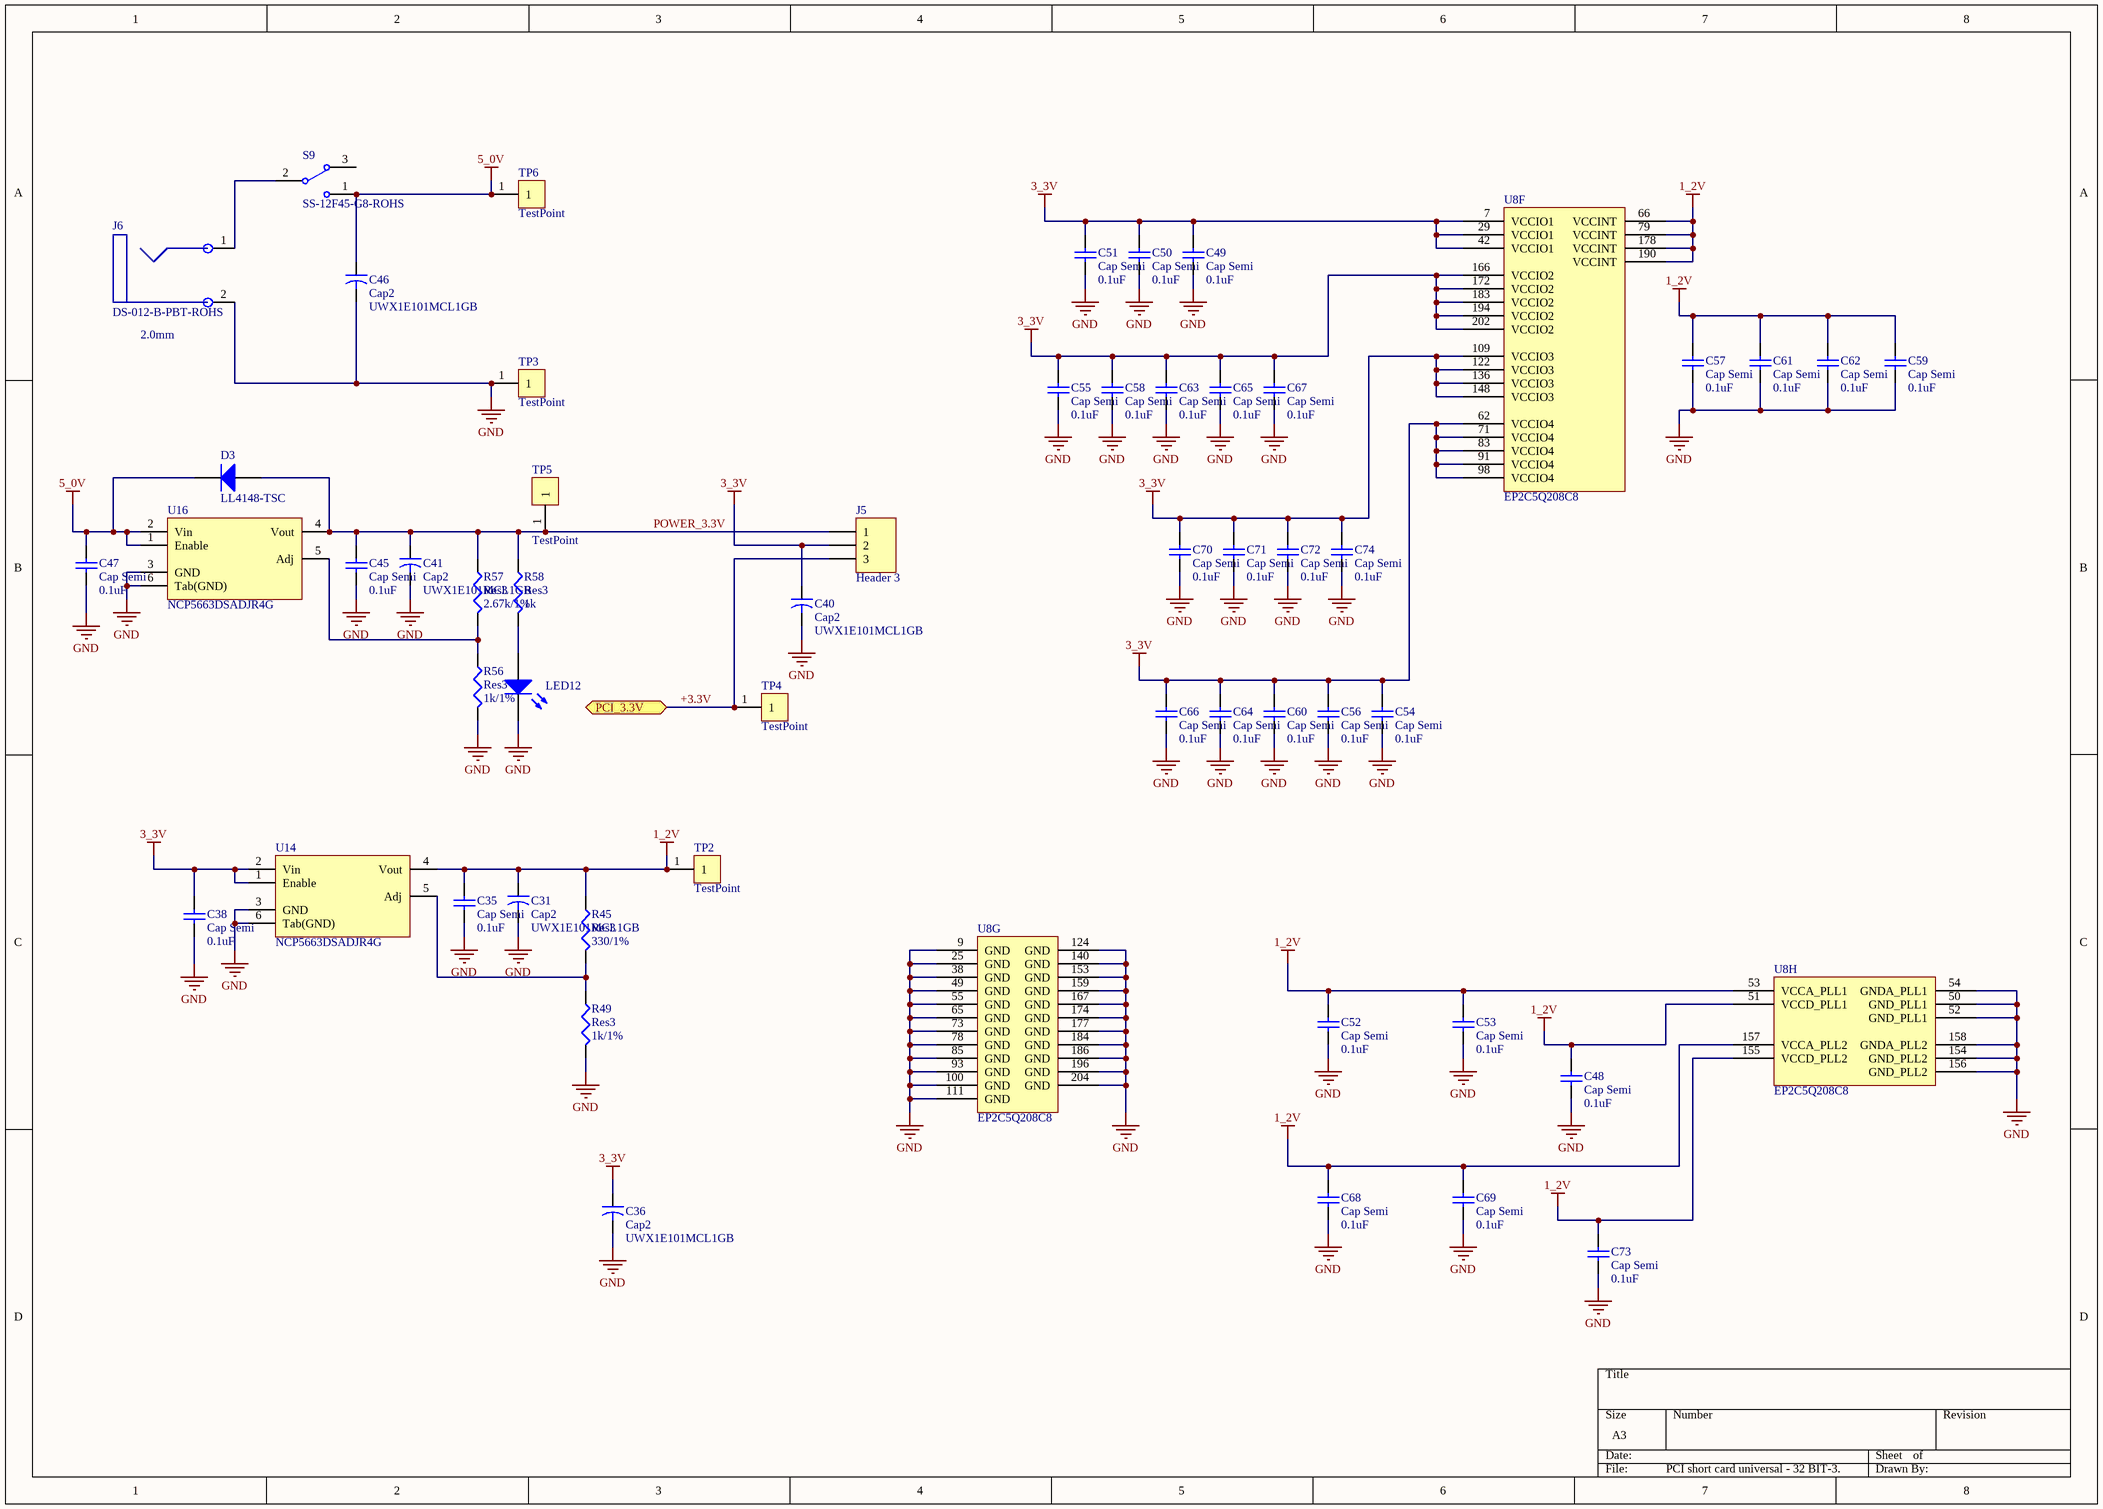
[diagram p2: PCI short card universal - 32 BIT-3.schdoc]

### Parts
C31  Cap2  value UWX1E101MCL1GB  [ECEL_D8]
C35  Cap Semi  value 0.1uF  [RESC1608N]
C36  Cap2  value UWX1E101MCL1GB  [ECEL_D8]
C38  Cap Semi  value 0.1uF  [RESC1608N]
C40  Cap2  value UWX1E101MCL1GB  [ECEL_D8]
C41  Cap2  value UWX1E101MCL1GB  [ECEL_D8]
C45  Cap Semi  value 0.1uF  [RESC1608N]
C46  Cap2  value UWX1E101MCL1GB  [ECEL_D8]
C47  Cap Semi  value 0.1uF  [RESC1608N]
C48  Cap Semi  value 0.1uF  [RESC1608N]
C49  Cap Semi  value 0.1uF  [RESC1608N]
C50  Cap Semi  value 0.1uF  [RESC1608N]
C51  Cap Semi  value 0.1uF  [RESC1608N]
C52  Cap Semi  value 0.1uF  [RESC1608N]
C53  Cap Semi  value 0.1uF  [RESC1608N]
C54  Cap Semi  value 0.1uF  [RESC1608N]
C55  Cap Semi  value 0.1uF  [RESC1608N]
C56  Cap Semi  value 0.1uF  [RESC1608N]
C57  Cap Semi  value 0.1uF  [RESC1608N]
C58  Cap Semi  value 0.1uF  [RESC1608N]
C59  Cap Semi  value 0.1uF  [RESC1608N]
C60  Cap Semi  value 0.1uF  [RESC1608N]
C61  Cap Semi  value 0.1uF  [RESC1608N]
C62  Cap Semi  value 0.1uF  [RESC1608N]
C63  Cap Semi  value 0.1uF  [RESC1608N]
C64  Cap Semi  value 0.1uF  [RESC1608N]
C65  Cap Semi  value 0.1uF  [RESC1608N]
C66  Cap Semi  value 0.1uF  [RESC1608N]
C67  Cap Semi  value 0.1uF  [RESC1608N]
C68  Cap Semi  value 0.1uF  [RESC1608N]
C69  Cap Semi  value 0.1uF  [RESC1608N]
C70  Cap Semi  value 0.1uF  [RESC1608N]
C71  Cap Semi  value 0.1uF  [RESC1608N]
C72  Cap Semi  value 0.1uF  [RESC1608N]
C73  Cap Semi  value 0.1uF  [RESC1608N]
C74  Cap Semi  value 0.1uF  [RESC1608N]
D3  LL4148-TSC  [SOD80C]
J5  Header 3  [HDR1X3]
J6  DS-012-B-PBT-ROHS  [JACK]
LED12  LED2  [LED3.2X1.6X1.1]  (value not drawn)
R45  Res3  value 330/1%  [RESC1608N]
R49  Res3  value 1k/1%  [RESC1608N]
R56  Res3  value 1k/1%  [RESC1608N]
R57  Res3  value 2.67k/1%  [RESC1608N]
R58  Res3  value 1k  [RESC1608N]
S9  SS-12F45-G8-ROHS  [SLIDE_SW_2TYPE]
TP2  TestPoint  [HDR1X1]
TP3  TestPoint  [HDR1X1]
TP4  TestPoint  [HDR1X1]
TP5  TestPoint  [HDR1X1]
TP6  TestPoint  [HDR1X1]
U8  EP2C5Q208C8  [PQFP208_N]  (parts F,G,H of 9)
U14  NCP5663DSADJR4G  [D2PAK(936AA)]
U16  NCP5663DSADJR4G  [D2PAK(936AA)]

### Ports
PCI_3.3V

### Nets
1_2V: C31.1 C35.2 C48.2 C52.2 C53.2 C57.2 C59.2 C61.2 C62.2 C68.2 C69.2 C73.2 R45.1 TP2.1 U8.51(VCCD_PLL1) U8.53(VCCA_PLL1) U8.66(VCCINT) U8.79(VCCINT) U8.155(VCCD_PLL2) U8.157(VCCA_PLL2) U8.178(VCCINT) U8.190(VCCINT) U14.4(Vout)
3_3V: C36.1 C38.2 C40.1 C49.2 C50.2 C51.2 C54.2 C55.2 C56.2 C58.2 C60.2 C63.2 C64.2 C65.2 C66.2 C67.2 C70.2 C71.2 C72.2 C74.2 J5.2 U8.7(VCCIO1) U8.29(VCCIO1) U8.42(VCCIO1) U8.62(VCCIO4) U8.71(VCCIO4) U8.83(VCCIO4) U8.91(VCCIO4) U8.98(VCCIO4) U8.109(VCCIO3) U8.122(VCCIO3) U8.136(VCCIO3) U8.148(VCCIO3) U8.166(VCCIO2) U8.172(VCCIO2) U8.183(VCCIO2) U8.194(VCCIO2) U8.202(VCCIO2) U14.1(Enable) U14.2(Vin)
5_0V: C46.1 C47.2 D3.2(K) S9.1 TP6.1 U16.1(Enable) U16.2(Vin)
GND: C31.2 C35.1 C36.2 C38.1 C40.2 C41.2 C45.1 C46.2 C47.1 C48.1 C49.1 C50.1 C51.1 C52.1 C53.1 C54.1 C55.1 C56.1 C57.1 C58.1 C59.1 C60.1 C61.1 C62.1 C63.1 C64.1 C65.1 C66.1 C67.1 C68.1 C69.1 C70.1 C71.1 C72.1 C73.1 C74.1 J6.2 LED12.2(K) R49.2 R56.2 TP3.1 U8.9(GND) U8.25(GND) U8.38(GND) U8.49(GND) U8.50(GND_PLL1) U8.52(GND_PLL1) U8.54(GNDA_PLL1) U8.55(GND) U8.65(GND) U8.73(GND) U8.78(GND) U8.85(GND) U8.93(GND) U8.100(GND) U8.111(GND) U8.124(GND) U8.140(GND) U8.153(GND) U8.154(GND_PLL2) U8.156(GND_PLL2) U8.158(GNDA_PLL2) U8.159(GND) U8.167(GND) U8.174(GND) U8.177(GND) U8.184(GND) U8.186(GND) U8.196(GND) U8.204(GND) U14.3(GND) U14.6(Tab(GND)) U16.3(GND) U16.6(Tab(GND))
+3.3V: J5.3 TP4.1 ; port PCI_3.3V
POWER_3.3V: C41.1 C45.2 D3.1(A) J5.1 R57.1 R58.1 TP5.1 U16.4(Vout)
NetJ6_1: J6.1 S9.2
NetLED12_1: LED12.1(A) R58.2
NetR45_2: R45.2 R49.1 U14.5(Adj)
NetR56_1: R56.1 R57.2 U16.5(Adj)

Not connected (* = marked no-connect by the designer): S9 3

### Notes on the sheet
- (near J6) 2.0mm

### Library data of the parts
C31 C36 C40 C41 C46 = Cap2: NICHICON; Published: 23-Sep-2002; PackageReference: CAPR5-4X5; Publisher: Altium Limited
C35 C38 C45 C47-C74 = Cap Semi: Capacitor (Semiconductor SIM Model); Published: 8-Jun-2000; LatestRevisionDate: 17-Jul-2002; LatestRevisionNote: Re-released for DXP Platform.; PackageReference: C1206; Publisher: Altium Limited
D3 = BAS32L: TAIWAN SEMICONDUCTOR; Published: 17-Sep-2003; LatestRevisionDate: 19-Mar-2004; LatestRevisionNote: Silkscreen size reduced.; DatasheetVersion: 23-Jan-2002; PackageVersion: Jan-2002; PackageReference: SOD80C; Publisher: Altium Limited; PackageDescription: Metal Electrode Face (MELF) Diode; Body 3.5 x 1.6 mm (LxDia); ComponentLink1Description: Manufacturer Link; ComponentLink1URL: http://www.semiconductors.philips.com/; ComponentLink2Description: Datasheet; ComponentLink2URL: http://www.semiconductors.philips.com/acrobat/datasheets/BAS32L_4.pdf
J5 = Header 3: Header, 3-Pin; LatestRevisionDate: 17-Jul-2002; LatestRevisionNote: Re-released for DXP Platform.; Publisher: Altium Limited
J6 = JACK2.5mm: WEALTH METAL
LED12 = LED2: OASISTEK (TO-3216BC-MAE); Published: 8-Jun-2000; LatestRevisionDate: 17-Jul-2002; LatestRevisionNote: Re-released for DXP Platform.; PackageDocument: Feb-2002; PackageReference: 3.2X1.6X1.1; Publisher: Altium Limited
R45 R49 R56-R58 = Res3: Resistor; Published: 8-Jun-2000; LatestRevisionDate: 04-Mar-2005; LatestRevisionNote: PCB Footprint replaced.; PackageReference: J1-0603; Publisher: Altium Limited
S9 = SW-SPDT: WEALTH METAL; Published: 24-Mar-1999; LatestRevisionDate: 17-Dec-2003; LatestRevisionNote: Schematic revised, PCB Footprint replaced.; DatasheetDocument: 05-Dec-2000; PackageReference: TL36WW15050; Publisher: Altium Limited; ComponentLink1Description: Manufacturer Link; ComponentLink1URL: http://www.apem.com
U8 = EP2C5Q208C8: as U8 on sheet PCI short card universal - 32 BIT; Published: 4-Mar-2005; LatestRevisionDate: 13-Apr-2006; LatestRevisionNote: IPC-7351 Footprint Added.; DatasheetVersion: ver2.3, Mar-2006; PackageVersion: ver14.2, Oct-2005; PackageReference: PQFP208; Publisher: Altium Limited; PackageDescription: 208-Pin Plastic Quad Flat Pack (PQFP208); Code_JEDEC: MS-029-FA-1; ComponentLink1Description: Manufacturer Link; ComponentLink1URL: http://www.altera.com/products/devices/cyclone2/cy2-index.jsp; ComponentLink2Description: Handbook; ComponentLink2URL: http://www.altera.com/literature/hb/cyc2/cyc2_cii5v1.pdf; ComponentLink3Description: Packaging Specification; ComponentLink3URL: http://www.altera.com/literature/ds/dspkg.pdf
U14 U16 = NCP5663DSADJR4G: ON SEMI

## Sheet PCI short card universal - 32 BIT-4.schdoc
size A3
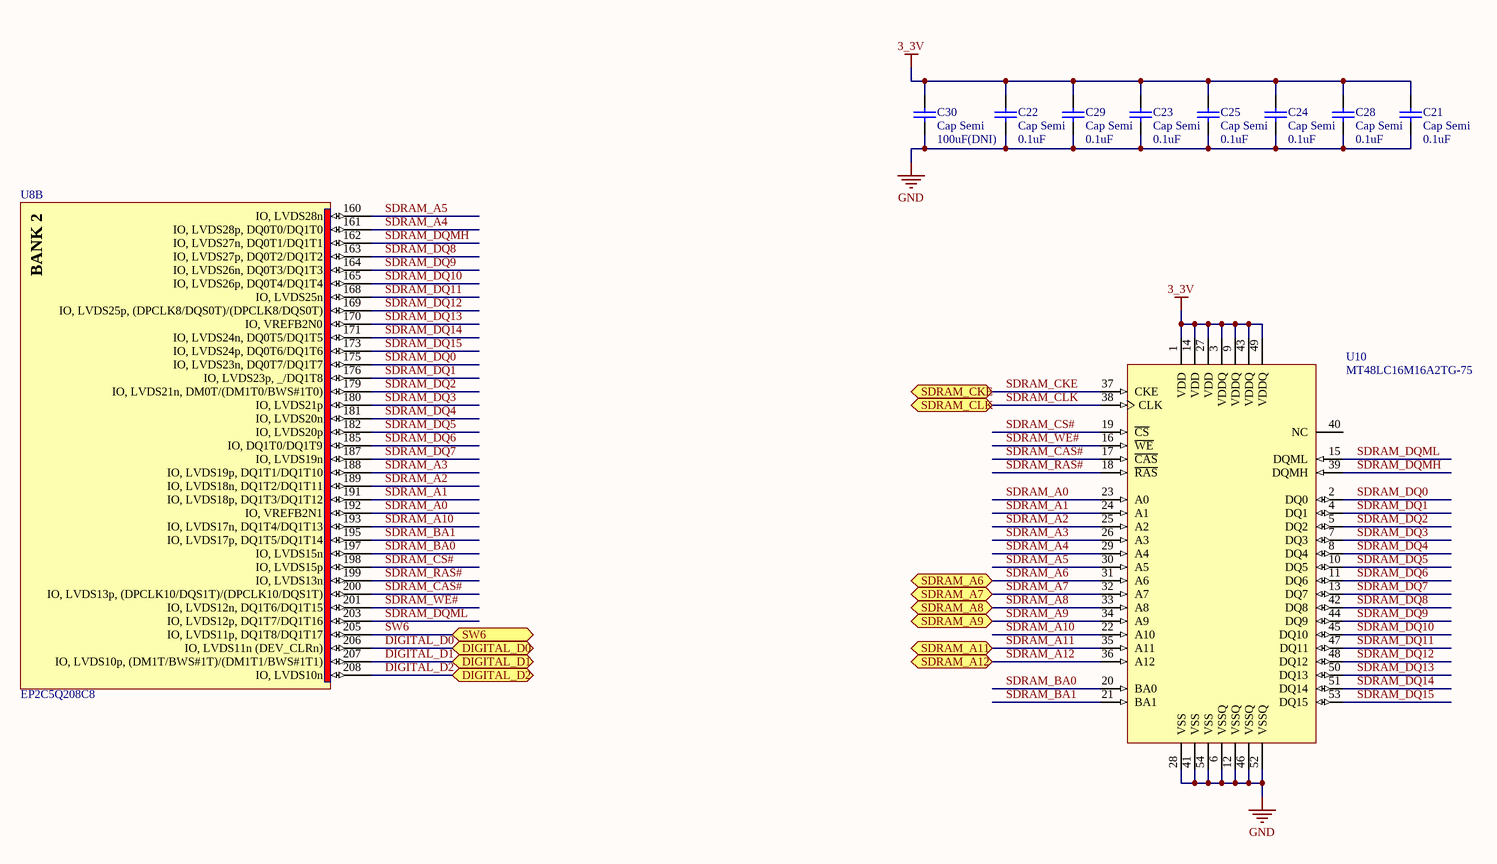
[diagram p3: PCI short card universal - 32 BIT-4.schdoc]

### Parts
C21  Cap Semi  value 0.1uF  [RESC1608N]
C22  Cap Semi  value 0.1uF  [RESC1608N]
C23  Cap Semi  value 0.1uF  [RESC1608N]
C24  Cap Semi  value 0.1uF  [RESC1608N]
C25  Cap Semi  value 0.1uF  [RESC1608N]
C28  Cap Semi  value 0.1uF  [RESC1608N]
C29  Cap Semi  value 0.1uF  [RESC1608N]
C30  Cap Semi  value 100uF(DNI)  [CD3225-1210]
U8  EP2C5Q208C8  [PQFP208_N]  (part B of 9)
U10  MT48LC16M16A2TG-75  [TSOP2-54_M]

### Ports
DIGITAL_D0, DIGITAL_D1, DIGITAL_D2, SDRAM_A6, SDRAM_A7, SDRAM_A8, SDRAM_A9, SDRAM_A11, SDRAM_A12, SDRAM_CKE, SDRAM_CLK, SW6

### Nets
3_3V: C21.2 C22.2 C23.2 C24.2 C25.2 C28.2 C29.2 C30.2 U10.1(VDD) U10.3(VDDQ) U10.9(VDDQ) U10.14(VDD) U10.27(VDD) U10.43(VDDQ) U10.49(VDDQ)
GND: C21.1 C22.1 C23.1 C24.1 C25.1 C28.1 C29.1 C30.1 U10.6(VSSQ) U10.12(VSSQ) U10.28(VSS) U10.41(VSS) U10.46(VSSQ) U10.52(VSSQ) U10.54(VSS)
DIGITAL_D0: U8.206(IO,_LVDS11n_(DEV_CLRn)) ; port DIGITAL_D0
DIGITAL_D1: U8.207(IO,_LVDS10p,_(DM1T/BWS#1T)/(DM1T1/BWS#1T1)) ; port DIGITAL_D1
DIGITAL_D2: U8.208(IO,_LVDS10n) ; port DIGITAL_D2
SDRAM_A0: U8.192(IO,_VREFB2N1) U10.23(A0)
SDRAM_A1: U8.191(IO,_LVDS18p,_DQ1T3/DQ1T12) U10.24(A1)
SDRAM_A2: U8.189(IO,_LVDS18n,_DQ1T2/DQ1T11) U10.25(A2)
SDRAM_A3: U8.188(IO,_LVDS19p,_DQ1T1/DQ1T10) U10.26(A3)
SDRAM_A4: U8.161(IO,_LVDS28p,_DQ0T0/DQ1T0) U10.29(A4)
SDRAM_A5: U8.160(IO,_LVDS28n) U10.30(A5)
SDRAM_A6: U10.31(A6) ; port SDRAM_A6
SDRAM_A7: U10.32(A7) ; port SDRAM_A7
SDRAM_A8: U10.33(A8) ; port SDRAM_A8
SDRAM_A9: U10.34(A9) ; port SDRAM_A9
SDRAM_A10: U8.193(IO,_LVDS17n,_DQ1T4/DQ1T13) U10.22(A10)
SDRAM_A11: U10.35(A11) ; port SDRAM_A11
SDRAM_A12: U10.36(A12) ; port SDRAM_A12
SDRAM_BA0: U8.197(IO,_LVDS15n) U10.20(BA0)
SDRAM_BA1: U8.195(IO,_LVDS17p,_DQ1T5/DQ1T14) U10.21(BA1)
SDRAM_CAS#: U8.200(IO,_LVDS13p,_(DPCLK10/DQS1T)/(DPCLK10/DQS1T)) U10.17(~{CAS})
SDRAM_CKE: U10.37(CKE) ; port SDRAM_CKE
SDRAM_CLK: U10.38(CLK) ; port SDRAM_CLK
SDRAM_CS#: U8.198(IO,_LVDS15p) U10.19(~{CS})
SDRAM_DQ0: U8.175(IO,_LVDS23n,_DQ0T7/DQ1T7) U10.2(DQ0)
SDRAM_DQ1: U8.176(IO,_LVDS23p,__/DQ1T8) U10.4(DQ1)
SDRAM_DQ2: U8.179(IO,_LVDS21n,_DM0T/(DM1T0/BWS#1T0)) U10.5(DQ2)
SDRAM_DQ3: U8.180(IO,_LVDS21p) U10.7(DQ3)
SDRAM_DQ4: U8.181(IO,_LVDS20n) U10.8(DQ4)
SDRAM_DQ5: U8.182(IO,_LVDS20p) U10.10(DQ5)
SDRAM_DQ6: U8.185(IO,_DQ1T0/DQ1T9) U10.11(DQ6)
SDRAM_DQ7: U8.187(IO,_LVDS19n) U10.13(DQ7)
SDRAM_DQ8: U8.163(IO,_LVDS27p,_DQ0T2/DQ1T2) U10.42(DQ8)
SDRAM_DQ9: U8.164(IO,_LVDS26n,_DQ0T3/DQ1T3) U10.44(DQ9)
SDRAM_DQ10: U8.165(IO,_LVDS26p,_DQ0T4/DQ1T4) U10.45(DQ10)
SDRAM_DQ11: U8.168(IO,_LVDS25n) U10.47(DQ11)
SDRAM_DQ12: U8.169(IO,_LVDS25p,_(DPCLK8/DQS0T)/(DPCLK8/DQS0T)) U10.48(DQ12)
SDRAM_DQ13: U8.170(IO,_VREFB2N0) U10.50(DQ13)
SDRAM_DQ14: U8.171(IO,_LVDS24n,_DQ0T5/DQ1T5) U10.51(DQ14)
SDRAM_DQ15: U8.173(IO,_LVDS24p,_DQ0T6/DQ1T6) U10.53(DQ15)
SDRAM_DQMH: U8.162(IO,_LVDS27n,_DQ0T1/DQ1T1) U10.39(DQMH)
SDRAM_DQML: U8.203(IO,_LVDS12p,_DQ1T7/DQ1T16) U10.15(DQML)
SDRAM_RAS#: U8.199(IO,_LVDS13n) U10.18(~{RAS})
SDRAM_WE#: U8.201(IO,_LVDS12n,_DQ1T6/DQ1T15) U10.16(~{WE})
SW6: U8.205(IO,_LVDS11p,_DQ1T8/DQ1T17) ; port SW6

Not connected (* = marked no-connect by the designer): U10 40(NC)

### Notes on the sheet
- (in symbol EP2C5Q208C8, part B) BANK 2

### Library data of the parts
C21-C25 C28-C30 = Cap Semi: Capacitor (Semiconductor SIM Model); Published: 8-Jun-2000; LatestRevisionDate: 17-Jul-2002; LatestRevisionNote: Re-released for DXP Platform.; PackageReference: C1206; Publisher: Altium Limited
U8 = EP2C5Q208C8: as U8 on sheet PCI short card universal - 32 BIT; Published: 4-Mar-2005; LatestRevisionDate: 13-Apr-2006; LatestRevisionNote: IPC-7351 Footprint Added.; DatasheetVersion: ver2.3, Mar-2006; PackageVersion: ver14.2, Oct-2005; PackageReference: PQFP208; Publisher: Altium Limited; PackageDescription: 208-Pin Plastic Quad Flat Pack (PQFP208); Code_JEDEC: MS-029-FA-1; ComponentLink1Description: Manufacturer Link; ComponentLink1URL: http://www.altera.com/products/devices/cyclone2/cy2-index.jsp; ComponentLink2Description: Handbook; ComponentLink2URL: http://www.altera.com/literature/hb/cyc2/cyc2_cii5v1.pdf; ComponentLink3Description: Packaging Specification; ComponentLink3URL: http://www.altera.com/literature/ds/dspkg.pdf
U10 = MT48LC16M16A2TG-75: MICRON; CycleTime: 7.5ns @ CL = 3 (PC133); RowAddress: 8K (A0-A12); ColumnAddress: 512 (A0-A8); Published: 11-Oct-2004; LatestRevisionDate: 13-Apr-2006; LatestRevisionNote: IPC-7351 Footprint Added.; DatasheetVersion: rev.G, Sep-2003; PackageVersion: Sep-2003; PackageReference: TSOP2-54; Publisher: Altium Limited; PackageDescription: 54-Pin Plastic Small Outline Package 0.8 mm Pitch; Code_JEDEC: MS-024-FA; ComponentLink1Description: Manufacturer Link; ComponentLink1URL: http://www.micron.com; ComponentLink2Description: Datasheet; ComponentLink2URL: http://download.micron.com/pdf/datasheets/dram/sdram/256MSDRAM.pdf

## Sheet PCI short card universal - 32 BIT-5.schdoc
size A3
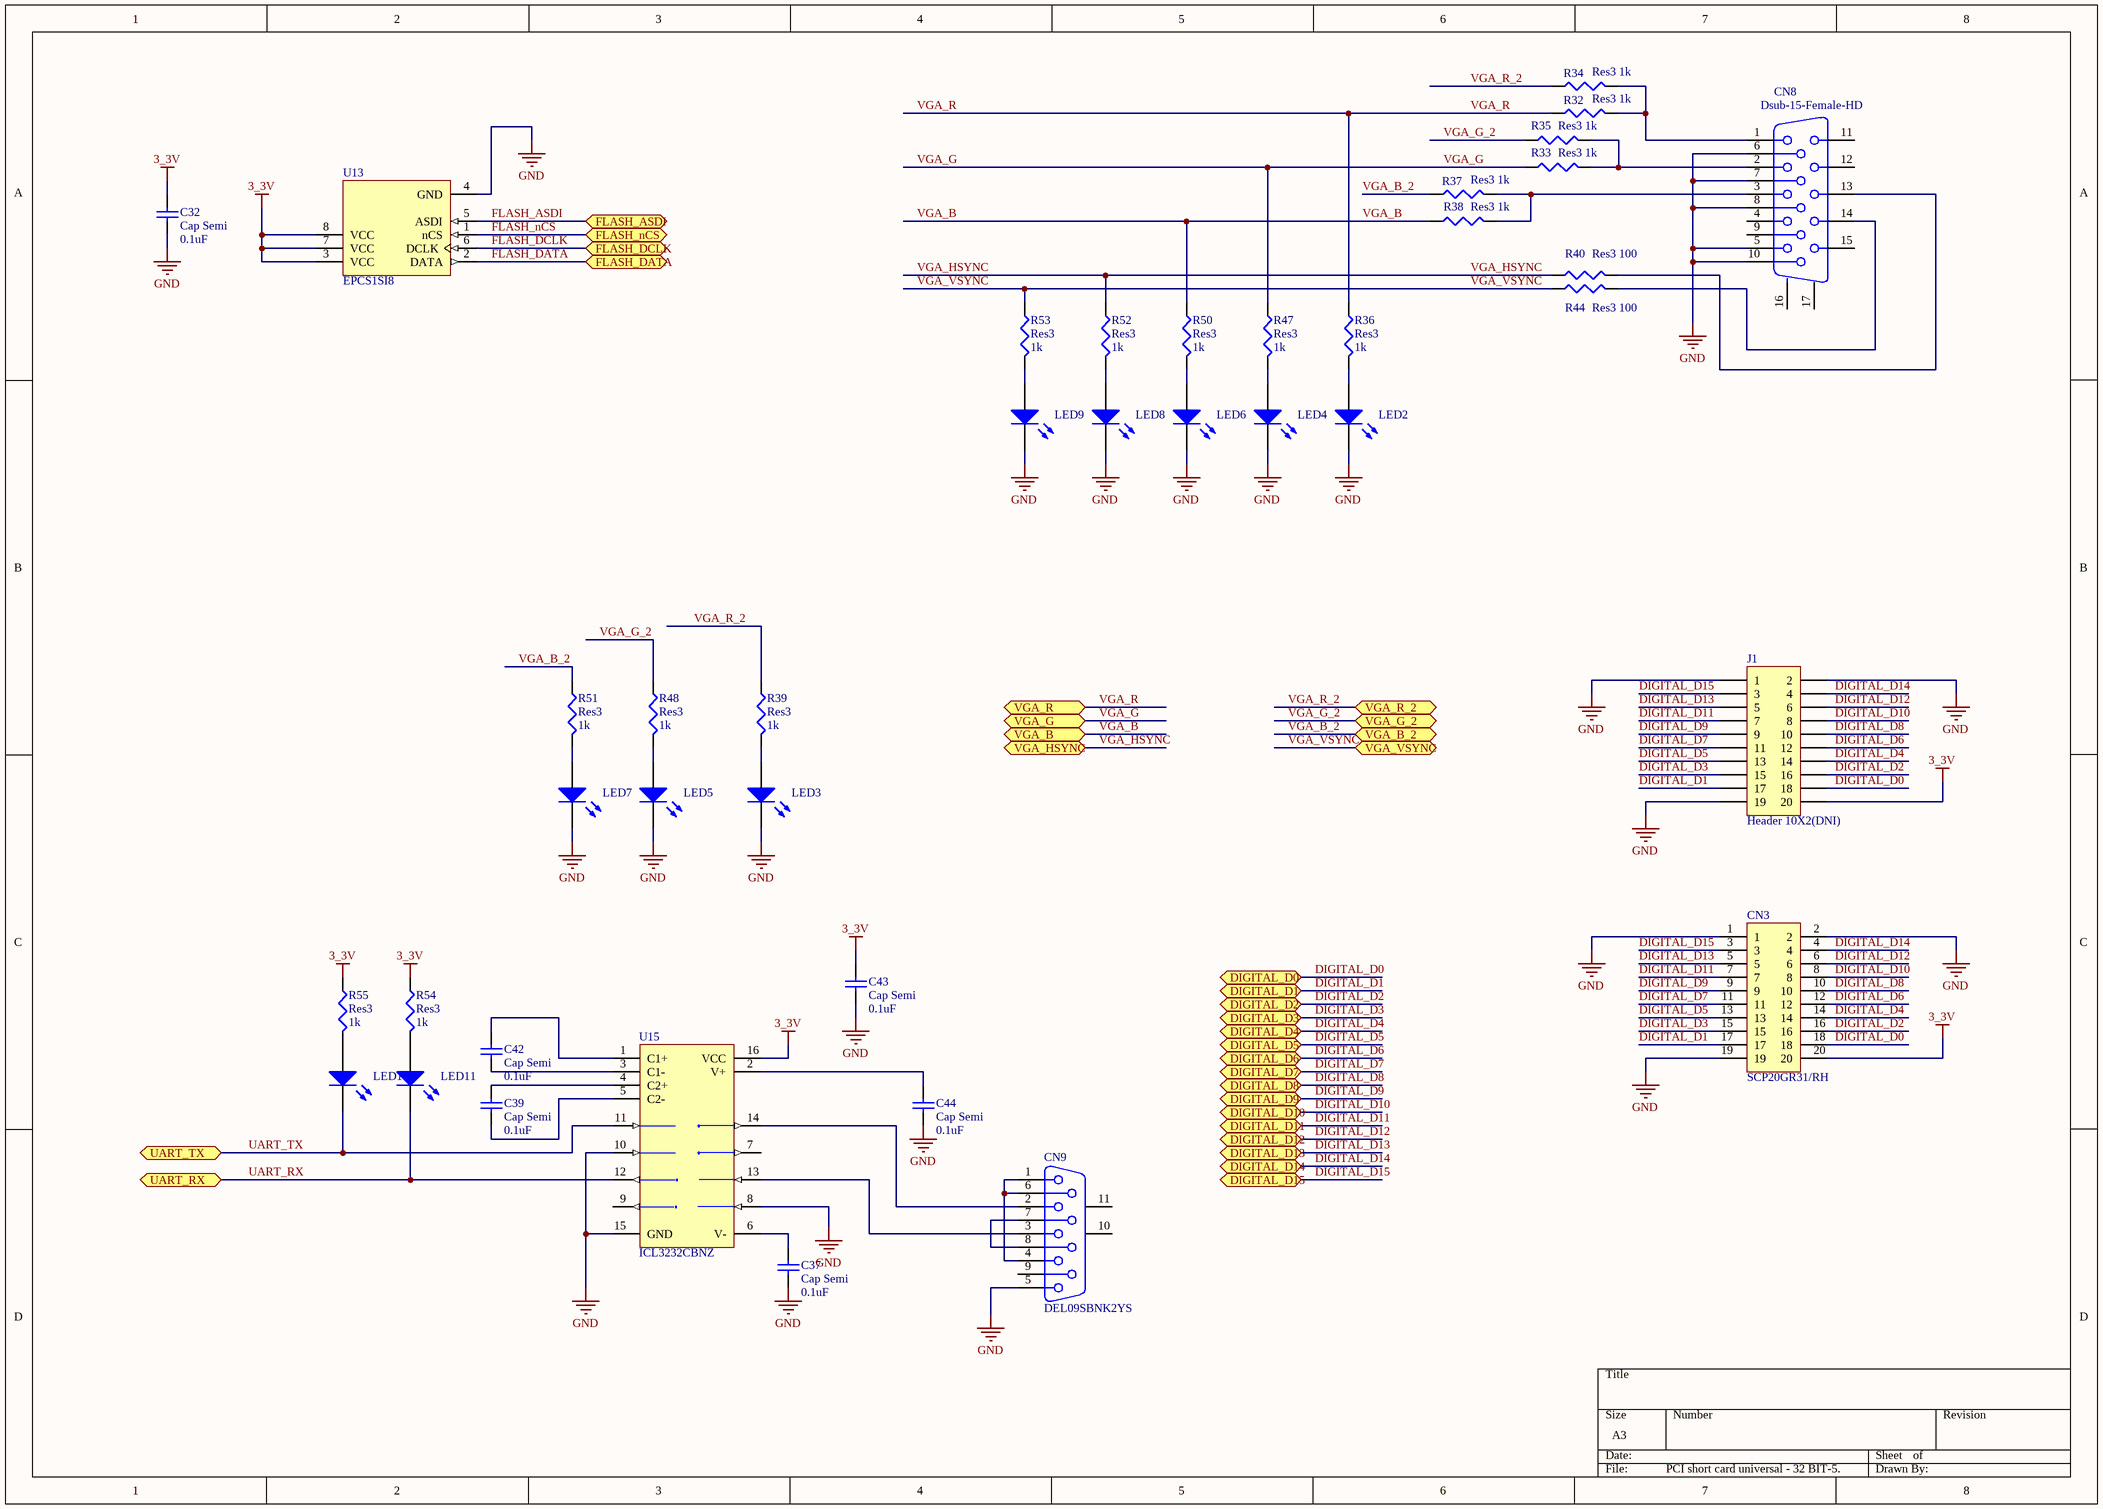
[diagram p4: PCI short card universal - 32 BIT-5.schdoc]

### Parts
C32  Cap Semi  value 0.1uF  [RESC1608N]
C37  Cap Semi  value 0.1uF  [RESC1608N]
C39  Cap Semi  value 0.1uF  [RESC1608N]
C42  Cap Semi  value 0.1uF  [RESC1608N]
C43  Cap Semi  value 0.1uF  [RESC1608N]
C44  Cap Semi  value 0.1uF  [RESC1608N]
CN3  SCP20GR31/RH  [SCP20GR31/RH]
CN8  Dsub-15-Female-HD  [DB15-VGA-Female]
CN9  DEL09SBNK2YS  [DSUB1.385-2H9]
J1  Header 10X2(DNI)  [HDR2X10]
LED2  LED2  [LED3.2X1.6X1.1]  (value not drawn)
LED3  LED2  [LED3.2X1.6X1.1]  (value not drawn)
LED4  LED2  [LED3.2X1.6X1.1]  (value not drawn)
LED5  LED2  [LED3.2X1.6X1.1]  (value not drawn)
LED6  LED2  [LED3.2X1.6X1.1]  (value not drawn)
LED7  LED2  [LED3.2X1.6X1.1]  (value not drawn)
LED8  LED2  [LED3.2X1.6X1.1]  (value not drawn)
LED9  LED2  [LED3.2X1.6X1.1]  (value not drawn)
LED10  LED2  [LED3.2X1.6X1.1]  (value not drawn)
LED11  LED2  [LED3.2X1.6X1.1]  (value not drawn)
R32  Res3  value 1k  [RESC1608N]
R33  Res3  value 1k  [RESC1608N]
R34  Res3  value 1k  [RESC1608N]
R35  Res3  value 1k  [RESC1608N]
R36  Res3  value 1k  [RESC1608N]
R37  Res3  value 1k  [RESC1608N]
R38  Res3  value 1k  [RESC1608N]
R39  Res3  value 1k  [RESC1608N]
R40  Res3  value 100  [RESC1608N]
R44  Res3  value 100  [RESC1608N]
R47  Res3  value 1k  [RESC1608N]
R48  Res3  value 1k  [RESC1608N]
R50  Res3  value 1k  [RESC1608N]
R51  Res3  value 1k  [RESC1608N]
R52  Res3  value 1k  [RESC1608N]
R53  Res3  value 1k  [RESC1608N]
R54  Res3  value 1k  [RESC1608N]
R55  Res3  value 1k  [RESC1608N]
U13  EPCS1SI8  [SOIC8_L]
U15  ICL3232CBNZ  [NSO16_M]

### Ports
DIGITAL_D0, DIGITAL_D1, DIGITAL_D2, DIGITAL_D3, DIGITAL_D4, DIGITAL_D5, DIGITAL_D6, DIGITAL_D7, DIGITAL_D8, DIGITAL_D9, DIGITAL_D10, DIGITAL_D11, DIGITAL_D12, DIGITAL_D13, DIGITAL_D14, DIGITAL_D15, FLASH_ASDI, FLASH_DATA, FLASH_DCLK, FLASH_nCS, UART_RX, UART_TX, VGA_B, VGA_B_2, VGA_G, VGA_G_2, VGA_HSYNC, VGA_R, VGA_R_2, VGA_VSYNC

### Nets
3_3V: C32.2 C43.2 CN3.20 J1.20 R54.1 R55.1 U13.3(VCC) U13.7(VCC) U13.8(VCC) U15.16(VCC)
GND: C32.1 C37.1 C43.1 C44.1 CN3.1 CN3.2 CN3.19 CN8.5 CN8.6 CN8.7 CN8.8 CN8.10 CN9.5 J1.1 J1.2 J1.19 LED2.2(K) LED3.2(K) LED4.2(K) LED5.2(K) LED6.2(K) LED7.2(K) LED8.2(K) LED9.2(K) U13.4(GND) U15.8(R2IN) U15.10(T2IN) U15.15(GND)
DIGITAL_D0: CN3.18 J1.18 ; port DIGITAL_D0
DIGITAL_D1: CN3.17 J1.17 ; port DIGITAL_D1
DIGITAL_D2: CN3.16 J1.16 ; port DIGITAL_D2
DIGITAL_D3: CN3.15 J1.15 ; port DIGITAL_D3
DIGITAL_D4: CN3.14 J1.14 ; port DIGITAL_D4
DIGITAL_D5: CN3.13 J1.13 ; port DIGITAL_D5
DIGITAL_D6: CN3.12 J1.12 ; port DIGITAL_D6
DIGITAL_D7: CN3.11 J1.11 ; port DIGITAL_D7
DIGITAL_D8: CN3.10 J1.10 ; port DIGITAL_D8
DIGITAL_D9: CN3.9 J1.9 ; port DIGITAL_D9
DIGITAL_D10: CN3.8 J1.8 ; port DIGITAL_D10
DIGITAL_D11: CN3.7 J1.7 ; port DIGITAL_D11
DIGITAL_D12: CN3.6 J1.6 ; port DIGITAL_D12
DIGITAL_D13: CN3.5 J1.5 ; port DIGITAL_D13
DIGITAL_D14: CN3.4 J1.4 ; port DIGITAL_D14
DIGITAL_D15: CN3.3 J1.3 ; port DIGITAL_D15
FLASH_ASDI: U13.5(ASDI) ; port FLASH_ASDI
FLASH_DATA: U13.2(DATA) ; port FLASH_DATA
FLASH_DCLK: U13.6(DCLK) ; port FLASH_DCLK
FLASH_nCS: U13.1(nCS) ; port FLASH_nCS
UART_RX: LED11.2(K) U15.12(R1OUT) ; port UART_RX
UART_TX: LED10.2(K) U15.11(T1IN) ; port UART_TX
VGA_B: R38.1 R50.1 ; port VGA_B
VGA_B_2: R37.1 R51.1 ; port VGA_B_2
VGA_G: R33.1 R47.1 ; port VGA_G
VGA_G_2: R35.1 R48.1 ; port VGA_G_2
VGA_HSYNC: R40.1 R52.1 ; port VGA_HSYNC
VGA_R: R32.1 R36.1 ; port VGA_R
VGA_R_2: R34.1 R39.1 ; port VGA_R_2
VGA_VSYNC: R44.1 R53.1 ; port VGA_VSYNC
NetC37_2: C37.2 U15.6(V-)
NetC39_1: C39.1 U15.5(C2-)
NetC39_2: C39.2 U15.4(C2+)
NetC42_1: C42.1 U15.3(C1-)
NetC42_2: C42.2 U15.1(C1+)
NetC44_2: C44.2 U15.2(V+)
NetCN8_1: CN8.1 R32.2 R34.2
NetCN8_2: CN8.2 R33.2 R35.2
NetCN8_3: CN8.3 R37.2 R38.2
NetCN8_13: CN8.13 R40.2
NetCN8_14: CN8.14 R44.2
NetCN9_1: CN9.1 CN9.4 CN9.6
NetCN9_2: CN9.2 U15.14(T1OUT)
NetCN9_3: CN9.3 U15.13(R1IN)
NetCN9_7: CN9.7 CN9.8
NetLED2_1: LED2.1(A) R36.2
NetLED3_1: LED3.1(A) R39.2
NetLED4_1: LED4.1(A) R47.2
NetLED5_1: LED5.1(A) R48.2
NetLED6_1: LED6.1(A) R50.2
NetLED7_1: LED7.1(A) R51.2
NetLED8_1: LED8.1(A) R52.2
NetLED9_1: LED9.1(A) R53.2
NetLED10_1: LED10.1(A) R55.2
NetLED11_1: LED11.1(A) R54.2

Not connected (* = marked no-connect by the designer): CN8 4 9 11 12 15 16(MH1) 17(MH2); CN9 9 10(MH1) 11(MH2); U15 7(T2OUT) 9(R2OUT)

### Library data of the parts
C32 C37 C39 C42-C44 = Cap Semi: Capacitor (Semiconductor SIM Model); Published: 8-Jun-2000; LatestRevisionDate: 17-Jul-2002; LatestRevisionNote: Re-released for DXP Platform.; PackageReference: C1206; Publisher: Altium Limited
CN3 = SCP20GR31/RH: GTK
CN8 = Dsub-15-Female-HD: Dsub-15 High density VGA Female connetor; Manufacturer: Generic Components; Package Information: Latest Revision: E; Class I: Connector; Positions: 30; Gender: Receptacle Header; Fitted: True; Published: 15-Jun-2001; Revision: July-2002: Re-released for DXP Platform.; Datasheet: (31-Oct-1991); Package Reference: 174213; Publisher: Altium Limited; Orientation: Right Angle
CN9 = D Connector 9: GTK; PackageDocument: O; Positions: 9; Gender: Receptacle; Published: 15-Jun-2001; LatestRevisionDate: 17-Jul-2002; LatestRevisionNote: Re-released for DXP Platform.; DatasheetDocument: 1-Sep-1999; PackageReference: 788750; Publisher: Altium Limited; Orientation: Right Angle
J1 = Header 10X2: Header, 10-Pin, Dual row; LatestRevisionDate: 17-Jul-2002; LatestRevisionNote: Re-released for DXP Platform.; Publisher: Altium Limited
LED2-LED9 = LED2: OASISTEK (TO-3216BC-MAE); Published: 8-Jun-2000; LatestRevisionDate: 17-Jul-2002; LatestRevisionNote: Re-released for DXP Platform.; PackageDocument: Feb-2002; PackageReference: 3.2X1.6X1.1; Publisher: Altium Limited
LED10 LED11 = LED2: Typical RED, GREEN, YELLOW, AMBER GaAs LED; Published: 8-Jun-2000; LatestRevisionDate: 17-Jul-2002; LatestRevisionNote: Re-released for DXP Platform.; PackageDocument: Feb-2002; PackageReference: 3.2X1.6X1.1; Publisher: Altium Limited
R32-R40 R44 R47 R48 R50-R55 = Res3: Resistor; Published: 8-Jun-2000; LatestRevisionDate: 04-Mar-2005; LatestRevisionNote: PCB Footprint replaced.; PackageReference: J1-0603; Publisher: Altium Limited
U13 = EPCS1SI8: as U6 on sheet PCI short card universal - 32 BIT-2; Published: 17-Sep-2003; LatestRevisionDate: 13-Apr-2006; LatestRevisionNote: IPC-7351 Footprint Added.; DatasheetVersion: ver2.0, Oct-2003; PackageVersion: ver13.0, May-2005; PackageReference: SOIC8; Publisher: Altium Limited; PackageDescription: 8-Pin Small Outline Integrated Circuit Package (SOIC8); Code_JEDEC: MS-012-AA; Code_IPC: SOIC127P600-8; ComponentLink1Description: Manufacturer Link; ComponentLink1URL: http://www.altera.com/products/devices/config/cfg-index.html; ComponentLink2Description: Configuration Handbook; ComponentLink2URL: http://www.altera.com/literature/hb/cfg/config_handbook.pdf; ComponentLink3Description: Pinout Specification; ComponentLink3URL: http://www.altera.com/literature/hb/cfg/cyc_c51014.pdf; ComponentLink4Description: Packaging Specification; ComponentLink4URL: http://www.altera.com/literature/ds/dspkg.pdf
U15 = MAX3232CSE: INTERSIL; Published: 16-Jan-2001; LatestRevisionDate: 13-Apr-2006; LatestRevisionNote: IPC-7351 Footprint Added.; DatasheetVersion: Mar-1999; PackageReference: NSO16; Publisher: Altium Limited; PackageDescription: 16-Pin Small Outline Integrated Circuit 1.27 mm Pitch; Code_JEDEC: MS-012-AC; Code_IPC: SOIC127P600-16; ComponentLink1Description: Manufacturer Link; ComponentLink1URL: http://www.maxim-ic.com/; ComponentLink2Description: Datasheet; ComponentLink2URL: http://pdfserv.maxim-ic.com/en/ds/MAX3222-MAX3241.pdf

## Sheet PCI short card universal - 32 BIT-6.schdoc
size A3
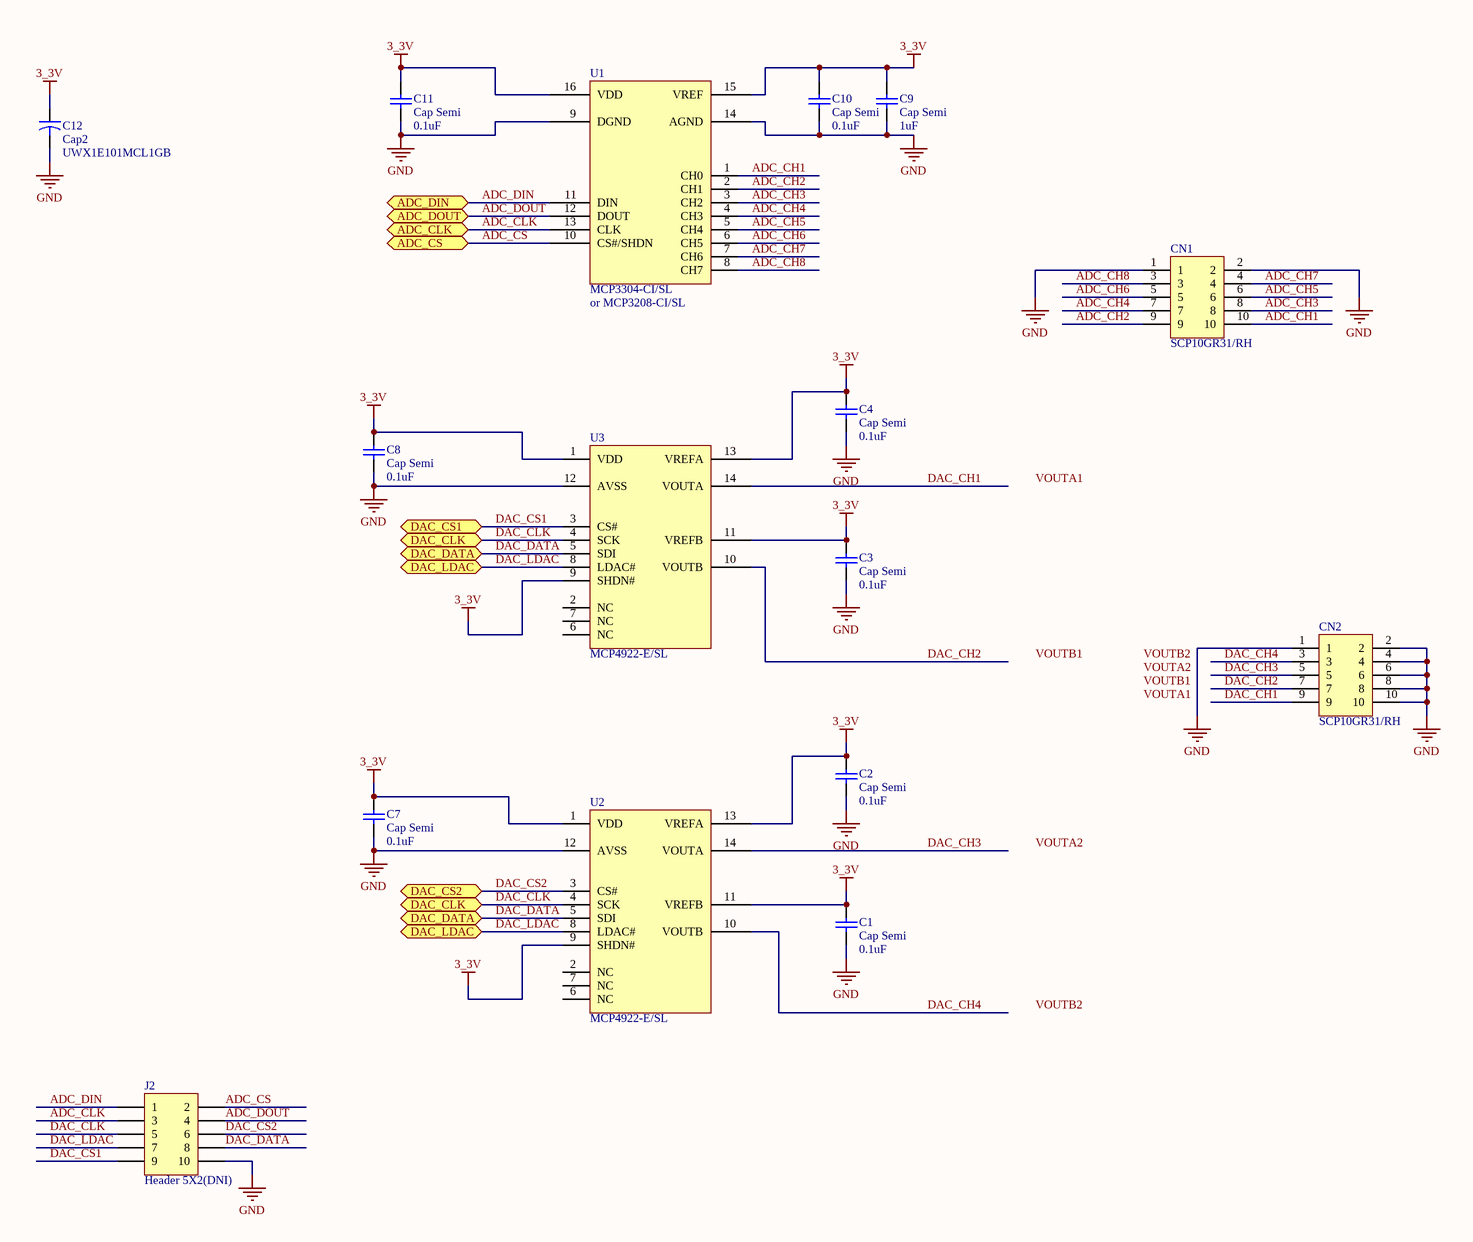
[diagram p5: PCI short card universal - 32 BIT-6.schdoc]

### Parts
C1  Cap Semi  value 0.1uF  [RESC1608N]
C2  Cap Semi  value 0.1uF  [RESC1608N]
C3  Cap Semi  value 0.1uF  [RESC1608N]
C4  Cap Semi  value 0.1uF  [RESC1608N]
C7  Cap Semi  value 0.1uF  [RESC1608N]
C8  Cap Semi  value 0.1uF  [RESC1608N]
C9  Cap Semi  value 1uF  [RESC1608N]
C10  Cap Semi  value 0.1uF  [RESC1608N]
C11  Cap Semi  value 0.1uF  [RESC1608N]
C12  Cap2  value UWX1E101MCL1GB  [ECEL_D8]
CN1  SCP10GR31/RH  [SCP10GR31/RH]
CN2  SCP10GR31/RH  [SCP10GR31/RH]
J2  Header 5X2(DNI)  [HDR2X5]
U1  MCP3304-CI/SL  [MCP3304-CI/SL]
U2  MCP4922-E/SL  [MCP4922-E/SL]
U3  MCP4922-E/SL  [MCP4922-E/SL]

### Ports
ADC_CLK, ADC_CS, ADC_DIN, ADC_DOUT, DAC_CLK, DAC_CS1, DAC_CS2, DAC_DATA, DAC_LDAC

### Nets
3_3V: C1.2 C2.2 C3.2 C4.2 C7.2 C8.2 C9.2 C10.2 C11.2 C12.1 U1.15(VREF) U1.16(VDD) U2.1(VDD) U2.9(SHDN#) U2.11(VREFB) U2.13(VREFA) U3.1(VDD) U3.9(SHDN#) U3.11(VREFB) U3.13(VREFA)
GND: C1.1 C2.1 C3.1 C4.1 C7.1 C8.1 C9.1 C10.1 C11.1 C12.2 CN1.1 CN1.2 CN2.1 CN2.2 CN2.4 CN2.6 CN2.8 CN2.10 J2.10 U1.9(DGND) U1.14(AGND) U2.12(AVSS) U3.12(AVSS)
ADC_CH1: CN1.10 U1.1(CH0)
ADC_CH2: CN1.9 U1.2(CH1)
ADC_CH3: CN1.8 U1.3(CH2)
ADC_CH4: CN1.7 U1.4(CH3)
ADC_CH5: CN1.6 U1.5(CH4)
ADC_CH6: CN1.5 U1.6(CH5)
ADC_CH7: CN1.4 U1.7(CH6)
ADC_CH8: CN1.3 U1.8(CH7)
ADC_CLK: J2.3 U1.13(CLK) ; port ADC_CLK
ADC_CS: J2.2 U1.10(CS#/SHDN) ; port ADC_CS
ADC_DIN: J2.1 U1.11(DIN) ; port ADC_DIN
ADC_DOUT: J2.4 U1.12(DOUT) ; port ADC_DOUT
DAC_CH1: CN2.9 U3.14(VOUTA)
DAC_CH2: CN2.7 U3.10(VOUTB)
DAC_CH3: CN2.5 U2.14(VOUTA)
DAC_CH4: CN2.3 U2.10(VOUTB)
DAC_CLK: J2.5 U2.4(SCK) U3.4(SCK) ; port DAC_CLK
DAC_CS1: J2.9 U3.3(CS#) ; port DAC_CS1
DAC_CS2: J2.6 U2.3(CS#) ; port DAC_CS2
DAC_DATA: J2.8 U2.5(SDI) U3.5(SDI) ; port DAC_DATA
DAC_LDAC: J2.7 U2.8(LDAC#) U3.8(LDAC#) ; port DAC_LDAC

Not connected (* = marked no-connect by the designer): U2 2(NC) 6(NC) 7(NC); U3 2(NC) 6(NC) 7(NC)

### Notes on the sheet
- (near U1) or MCP3208-CI/SL
- Labels drawn without touching a wire or pin: VOUTA1, VOUTA2, VOUTB1, VOUTB2

### Library data of the parts
C1-C4 C7-C11 = Cap Semi: Capacitor (Semiconductor SIM Model); Published: 8-Jun-2000; LatestRevisionDate: 17-Jul-2002; LatestRevisionNote: Re-released for DXP Platform.; PackageReference: C1206; Publisher: Altium Limited
C12 = Cap2: NICHICON; Published: 23-Sep-2002; PackageReference: CAPR5-4X5; Publisher: Altium Limited
CN1 CN2 = SCP10GR31/RH: GTK
J2 = Header 5X2: Header, 5-Pin, Dual row; LatestRevisionDate: 17-Jul-2002; LatestRevisionNote: Re-released for DXP Platform.; Publisher: Altium Limited
U1 = MCP3304-CI/SL: MICROCHIPS
U2 U3 = MCP4922-E/SL: MICROCHIPS

## Sheet PCI short card universal - 32 BIT-7.schdoc
size A3
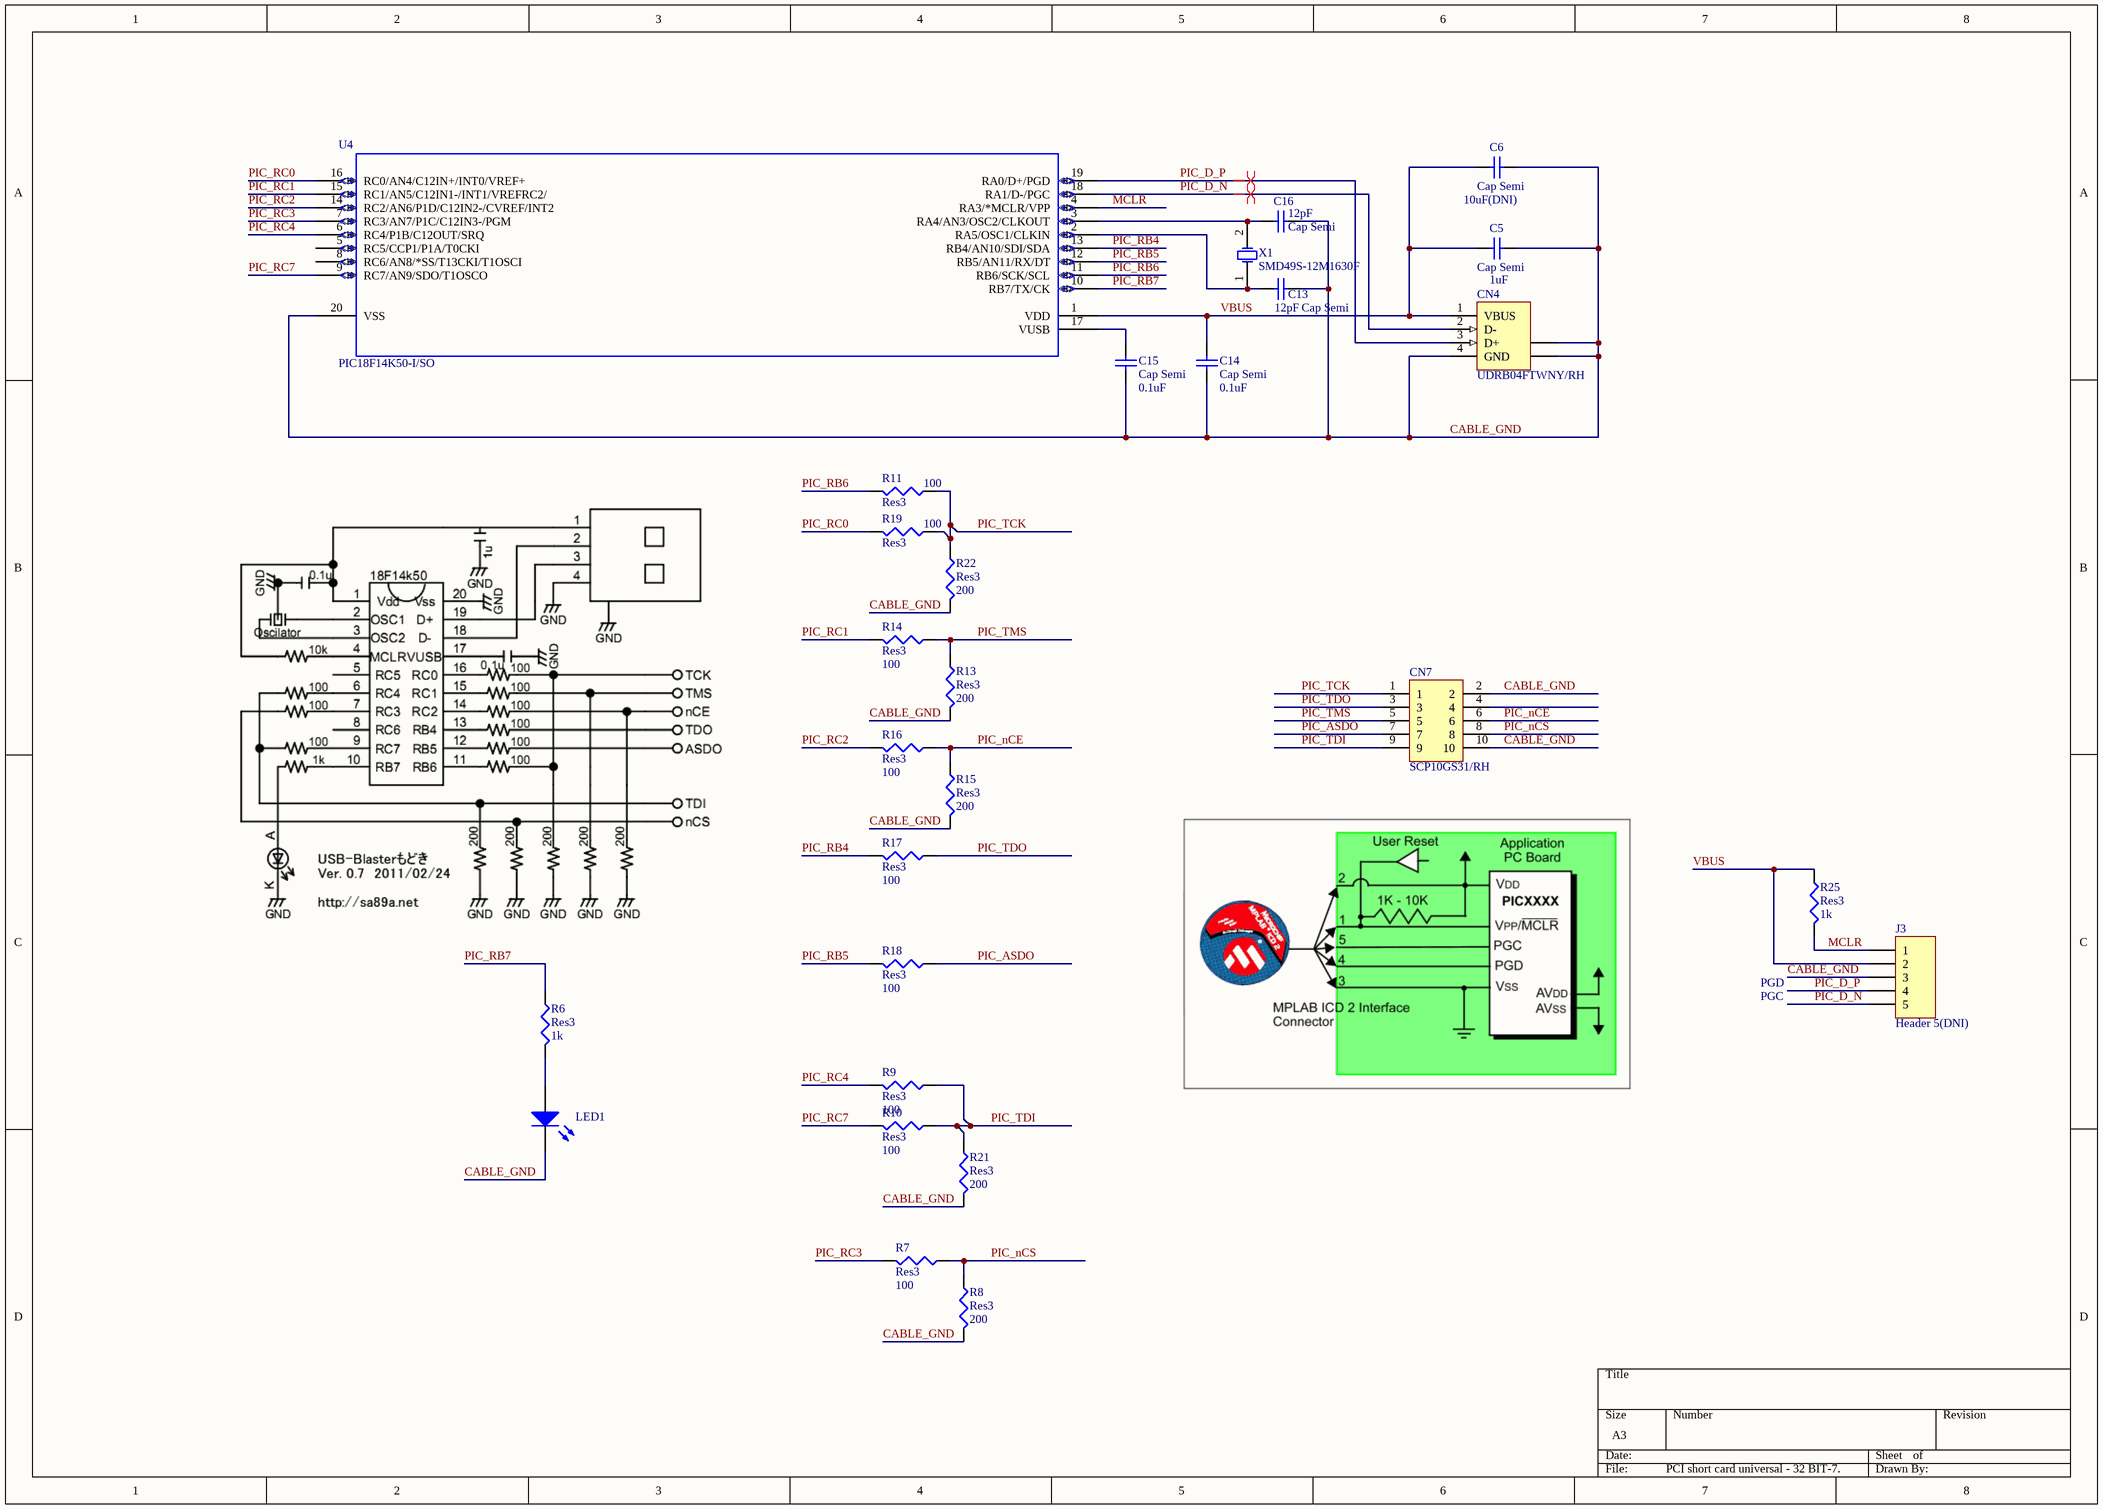
[diagram p6: PCI short card universal - 32 BIT-7.schdoc]

### Parts
C5  Cap Semi  value 1uF  [RESC1608N]
C6  Cap Semi  value 10uF(DNI)  [RESC2012N]
C13  Cap Semi  value 12pF  [RESC1608N]
C14  Cap Semi  value 0.1uF  [RESC1608N]
C15  Cap Semi  value 0.1uF  [RESC1608N]
C16  Cap Semi  value 12pF  [RESC1608N]
CN4  UDRB04FTWNY/RH  [1437106]
CN7  SCP10GS31/RH  [SCP10GS31/RH]
J3  Header 5(DNI)  [HDR1X5]
LED1  LED2  [LED3.2X1.6X1.1]  (value not drawn)
R6  Res3  value 1k  [RESC1608N]
R7  Res3  value 100  [RESC1608N]
R8  Res3  value 200  [RESC1608N]
R9  Res3  value 100  [RESC1608N]
R10  Res3  value 100  [RESC1608N]
R11  Res3  value 100  [RESC1608N]
R13  Res3  value 200  [RESC1608N]
R14  Res3  value 100  [RESC1608N]
R15  Res3  value 200  [RESC1608N]
R16  Res3  value 100  [RESC1608N]
R17  Res3  value 100  [RESC1608N]
R18  Res3  value 100  [RESC1608N]
R19  Res3  value 100  [RESC1608N]
R21  Res3  value 200  [RESC1608N]
R22  Res3  value 200  [RESC1608N]
R25  Res3  value 1k  [RESC1608N]
U4  PIC18F14K50-I/SO  [PIC18F14K50-SO]
X1  SMD49S-12M1630F  [ABLS-25.000MHZ-B2F-T]

### Nets
CABLE_GND: C5.1 C6.1 C13.1 C14.1 C15.1 C16.1 CN4.4(GND) CN4.5(SHLD) CN4.6(SHLD) CN7.2 CN7.10 J3.3 LED1.2(K) R8.2 R13.2 R15.2 R21.2 R22.2 U4.20(VSS)
MCLR: J3.1 R25.2 U4.4(RA3/*MCLR/VPP)
PIC_ASDO: CN7.7 R18.1
PIC_D_N: CN4.2(D-) J3.5 U4.18(RA1/D-/PGC)
PIC_D_P: CN4.3(D+) J3.4 U4.19(RA0/D+/PGD)
PIC_nCE: CN7.6 R15.1 R16.1
PIC_nCS: CN7.8 R7.1 R8.1
PIC_RB4: R17.2 U4.13(RB4/AN10/SDI/SDA)
PIC_RB5: R18.2 U4.12(RB5/AN11/RX/DT)
PIC_RB6: R11.2 U4.11(RB6/SCK/SCL)
PIC_RB7: R6.1 U4.10(RB7/TX/CK)
PIC_RC0: R19.2 U4.16(RC0/AN4/C12IN+/INT0/VREF+)
PIC_RC1: R14.2 U4.15(RC1/AN5/C12IN1-/INT1/VREFRC2/)
PIC_RC2: R16.2 U4.14(RC2/AN6/P1D/C12IN2-/CVREF/INT2)
PIC_RC3: R7.2 U4.7(RC3/AN7/P1C/C12IN3-/PGM)
PIC_RC4: R9.2 U4.6(RC4/P1B/C12OUT/SRQ)
PIC_RC7: R10.2 U4.9(RC7/AN9/SDO/T1OSCO)
PIC_TCK: CN7.1 R11.1 R19.1 R22.1
PIC_TDI: CN7.9 R9.1 R10.1 R21.1
PIC_TDO: CN7.3 R17.1
PIC_TMS: CN7.5 R13.1 R14.1
VBUS: C5.2 C6.2 C14.2 CN4.1(VBUS) J3.2 R25.1 U4.1(VDD)
NetC13_2: C13.2 U4.2(RA5/OSC1/CLKIN) X1.1(OSC1)
NetC15_2: C15.2 U4.17(VUSB)
NetC16_2: C16.2 U4.3(RA4/AN3/OSC2/CLKOUT) X1.2(OSC2)
NetLED1_1: LED1.1(A) R6.2

Not connected (* = marked no-connect by the designer): CN7 4; U4 5(RC5/CCP1/P1A/T0CKI) 8(RC6/AN8/*SS/T13CKI/T1OSCI)

### Layout directives
differential pair: PIC_D_N, PIC_D_P

### Notes on the sheet
- PGD
- PGC

### Library data of the parts
C5 C6 C13-C16 = Cap Semi: Capacitor (Semiconductor SIM Model); Published: 8-Jun-2000; LatestRevisionDate: 17-Jul-2002; LatestRevisionNote: Re-released for DXP Platform.; PackageReference: C1206; Publisher: Altium Limited
CN4 = 4-1437106-7: GTK; ContactMaterial: Copper Alloy; ContactPlating: Gold (30); TerminationLength: 2.90mm [0.114in.]; PCB_Layout: Complies with manufacturer's recommendation.; DrillSize: Corresponds to nominal value.; PanelGround: Without; Published: 15-Jul-2004; DatasheetDocument: 05-Jan-2004; PackageDocument: 05-Jan-2004; PackageReference: 1437106; Publisher: Altium Limited; HousingMaterial: Glass-Filled Thermoplastic; ComponentLink1Description: Manufacturer Link; ComponentLink1URL: http://www.tycoelectronics.com/; ComponentLink2Description: Packaging Specification; ComponentLink2URL: http://ecommas.tycoelectronics.com/commerce/DocumentDelivery/DDEController?Action=showdoc&DocId=Customer+Drawing%7F1437106%7FC%7Ftif%7FEnglish%7FENG_CD_1437106_C.tif
CN7 = SCP10GS31/RH: GTK
J3 = Header 5: Header, 5-Pin; LatestRevisionDate: 17-Jul-2002; LatestRevisionNote: Re-released for DXP Platform.; Publisher: Altium Limited
LED1 = LED2: OASISTEK (TO-3216BC-MAE); Published: 8-Jun-2000; LatestRevisionDate: 17-Jul-2002; LatestRevisionNote: Re-released for DXP Platform.; PackageDocument: Feb-2002; PackageReference: 3.2X1.6X1.1; Publisher: Altium Limited
R6-R11 R13-R19 R21 R22 R25 = Res3: Resistor; Published: 8-Jun-2000; LatestRevisionDate: 04-Mar-2005; LatestRevisionNote: PCB Footprint replaced.; PackageReference: J1-0603; Publisher: Altium Limited
U4 = PIC18F14K50: MICROCHIPS
X1 = ABLS-25.000MHZ-B2F-T: MEC